# EAGLE design Logger_v2 (EAGLE 8.1.0)

## Sheet 1 of 7: Main
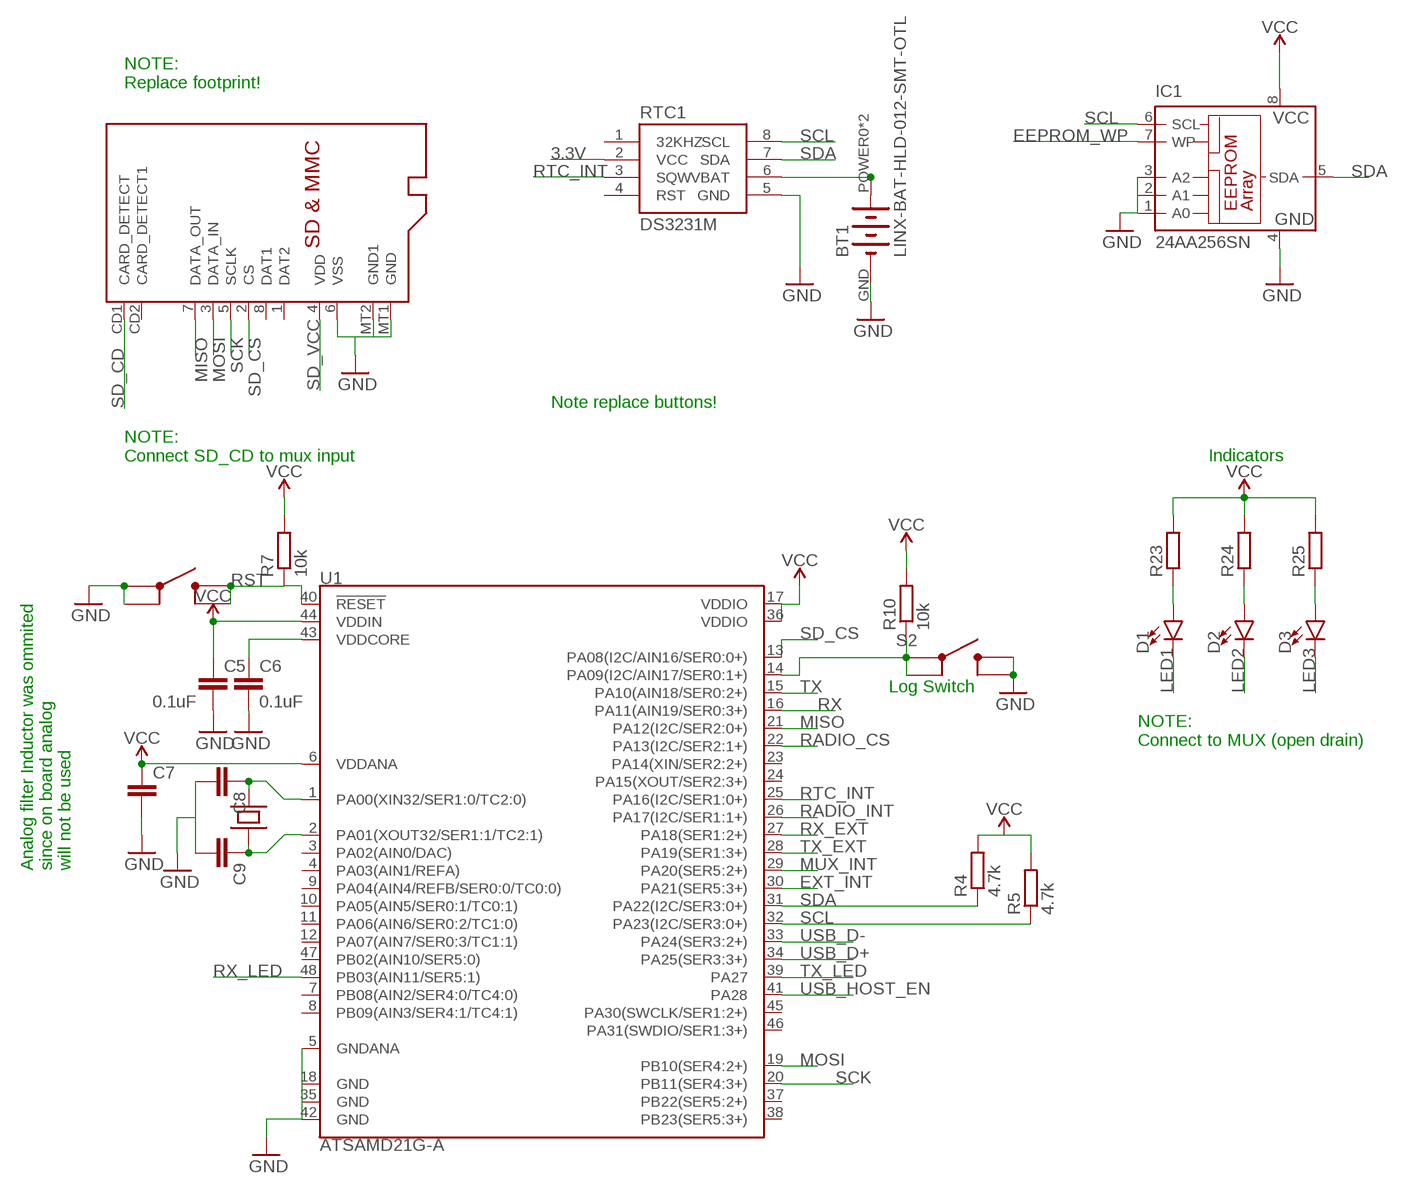
[diagram p0: schematic, sheet 1]

### Parts
BT1  LINX-BAT-HLD-012-SMT-OTL  [LINX_BAT-HLD-012-SMT]
C5  0.1uF  C-EUC0603  [C0603]
C6  0.1uF  C-EUC0603  [C0603]
C7  C-EUC0603  [C0603]
C8  C-EUC0603  [C0603]
C9  C-EUC0603  [C0603]
D1  LED0603  [LED-0603]
D2  LED0603  [LED-0603]
D3  LED0603  [LED-0603]
IC1  24AA256SN  [SO-08]
R4  4.7k  R-EU_R0603  [R0603]
R5  4.7k  R-EU_R0603  [R0603]
R7  10k  R-EU_R0603  [R0603]
R10  10k  R-EU_R0603  [R0603]
R23  R-EU_R0603  [R0603]
R24  R-EU_R0603  [R0603]
R25  R-EU_R0603  [R0603]
RTC1  DS3231M  [SO08]
S2  SKRPABE010  [SKRPABE010_(SWITCH)]
U1  ATSAMD21G-A  [TQFP-48]
U$1  SKRPABE010  [SKRPABE010_(SWITCH)]
U$2  MICROSD  [MICROSD]
U$5  CM200  [4-SOJ]

### Nets
3.3V: C5.1 C7.1 IC1.8(VCC) R4.2 R5.2 R7.2 R10.2 R23.2 R24.2 R25.2 RTC1.2(VCC) U1.6(VDDANA) U1.17(VDDIO) U1.36(VDDIO) U1.44(VDDIN) ; supply symbol labelled VCC ; also sheet 3,4,5,6,7
EEPROM_WP: IC1.7(WP)
EXT_INT: U1.30(PA21(SER5:3+)) ; also sheet 6
GND: BT1.GND(-) C5.2 C6.2 C7.2 C8.2 C9.2 IC1.1(A0) IC1.2(A1) IC1.3(A2) IC1.4(GND) RTC1.5(GND) S2.P$3 S2.P$4 U1.5(GNDANA) U1.18(GND) U1.42(GND) U$1.P$1 U$1.P$2 U$2.6(VSS) U$2.MT1(GND) U$2.MT2(GND1) ; also sheet 2,3,4,6,7
LED1: D1.C ; also sheet 7
LED2: D2.C ; also sheet 7
LED3: D3.C ; also sheet 7
MISO: U1.21(PA12(I2C/SER2:0+)) U$2.7(DATA_OUT) ; also sheet 4,6
MOSI: U1.19(PB10(SER4:2+)) U$2.3(DATA_IN) ; also sheet 4,6
MUX_INT: U1.29(PA20(SER5:2+)) ; also sheet 7
N$5: R10.1 S2.P$1 S2.P$2 U1.14(PA09(I2C/AIN17/SER0:1+))
N$8: C6.1 U1.43(VDDCORE)
N$9: C8.1 U1.1(PA00(XIN32/SER1:0/TC2:0)) U$5.P$4
N$10: C9.1 U1.2(PA01(XOUT32/SER1:1/TC2:1)) U$5.P$1
N$31: BT1.POWER0(+) BT1.POWER1(+) RTC1.6(VBAT)
N$32: D1.A R23.1
N$33: D2.A R24.1
N$34: D3.A R25.1
RADIO_CS: U1.22(PA13(I2C/SER2:1+)) ; also sheet 4
RADIO_INT: U1.26(PA17(I2C/SER1:1+)) ; also sheet 4
RST: R7.1 U1.40(!RESET!) U$1.P$3 U$1.P$4 ; also sheet 6
RTC_INT: RTC1.3(SQW) U1.25(PA16(I2C/SER1:0+))
RX: U1.16(PA11(AIN19/SER0:3+))
RX_EXT: U1.27(PA18(SER1:2+)) ; also sheet 6
RX_LED: U1.48(PB03(AIN11/SER5:1))
SCK: U1.20(PB11(SER4:3+)) U$2.5(SCLK) ; also sheet 4,6
SCL: IC1.6(SCL) R5.1 RTC1.8(SCL) U1.32(PA23(I2C/SER3:0+)) ; also sheet 4,6,7
SD_CD: U$2.CD1(CARD_DETECT)
SD_CS: U1.13(PA08(I2C/AIN16/SER0:0+)) U$2.2(CS)
SD_VCC: U$2.4(VDD) ; also sheet 5
SDA: IC1.5(SDA) R4.1 RTC1.7(SDA) U1.31(PA22(I2C/SER3:0+)) ; also sheet 4,6,7
TX: U1.15(PA10(AIN18/SER0:2+))
TX_EXT: U1.28(PA19(SER1:3+)) ; also sheet 6
TX_LED: U1.39(PA27)
USB_D+: U1.34(PA25(SER3:3+)) ; also sheet 6
USB_D-: U1.33(PA24(SER3:2+)) ; also sheet 6
USB_HOST_EN: U1.41(PA28) ; also sheet 6
Unconnected: RTC1.1(32KHZ) RTC1.4(RST) U1.3(PA02(AIN0/DAC)) U1.4(PA03(AIN1/REFA)) U1.7(PB08(AIN2/SER4:0/TC4:0)) U1.8(PB09(AIN3/SER4:1/TC4:1)) U1.9(PA04(AIN4/REFB/SER0:0/TC0:0)) U1.10(PA05(AIN5/SER0:1/TC0:1)) U1.11(PA06(AIN6/SER0:2/TC1:0)) U1.12(PA07(AIN7/SER0:3/TC1:1)) U1.23(PA14(XIN/SER2:2+)) U1.24(PA15(XOUT/SER2:3+)) U1.35(GND) U1.37(PB22(SER5:2+)) U1.38(PB23(SER5:3+)) U1.45(PA30(SWCLK/SER1:2+)) U1.46(PA31(SWDIO/SER1:3+)) U1.47(PB02(AIN10/SER5:0)) U$2.1(DAT2) U$2.8(DAT1) U$2.CD2(CARD_DETECT1)

### Notes on the sheet
- NOTE:
  Replace footprint!
- Note replace buttons!
- NOTE:
  Connect SD_CD to mux input
- Indicators
- Log Switch
- NOTE:
  Connect to MUX (open drain)
- Analog filter Inductor was ommited
  since on board analog
  will not be used

## Sheet 2 of 7: User Custom
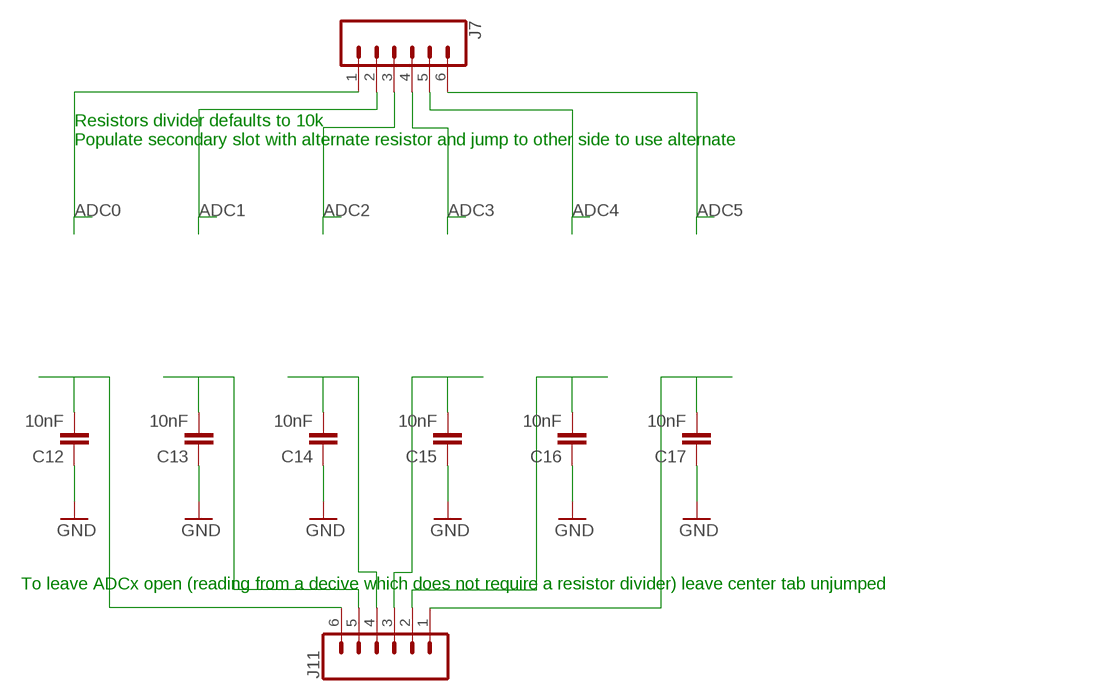
[diagram p1: schematic, sheet 2]

### Parts
C12  10nF  C-EUC0603  [C0603]
C13  10nF  C-EUC0603  [C0603]
C14  10nF  C-EUC0603  [C0603]
C15  10nF  C-EUC0603  [C0603]
C16  10nF  C-EUC0603  [C0603]
C17  10nF  C-EUC0603  [C0603]
J7  CONN_06SMD-STRAIGHT-FEMALE  [1X06_SMD_STRAIGHT]
J11  CONN_06SMD-STRAIGHT-FEMALE  [1X06_SMD_STRAIGHT]

### Nets
ADC0: J7.1 ; also sheet 6,7
ADC1: J7.2 ; also sheet 6,7
ADC2: J7.3 ; also sheet 6,7
ADC3: J7.4 ; also sheet 6,7
ADC4: J7.5 ; also sheet 6,7
ADC5: J7.6 ; also sheet 6,7
GND: C12.1 C13.1 C14.1 C15.1 C16.1 C17.1 ; also sheet 1,3,4,6,7
N$44: C12.2 J11.6
N$45: C13.2 J11.5
N$46: C14.2 J11.4
N$47: C15.2 J11.3
N$48: C16.2 J11.2
N$49: C17.2 J11.1

### Notes on the sheet
- Resistors divider defaults to 10k
  Populate secondary slot with alternate resistor and jump to other side to use alternate
- To leave ADCx open (reading from a decive which does not require a resistor divider) leave center tab unjumped

## Sheet 3 of 7: Power
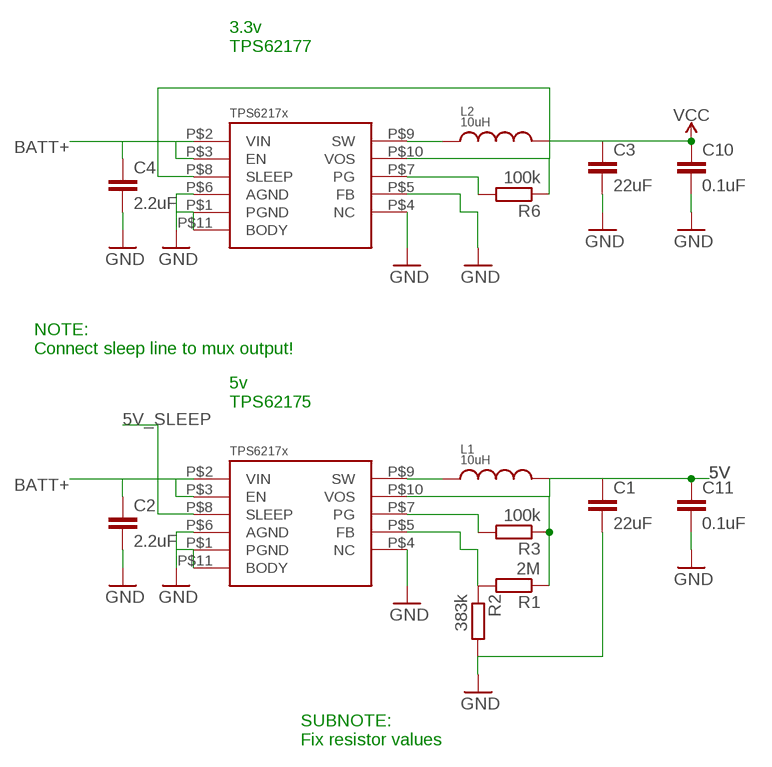
[diagram p2: schematic, sheet 3]

### Parts
C1  22uF  C-EUC1210  [C1210]
C2  2.2uF  C-EUC0603  [C0603]
C3  22uF  C-EUC1210  [C1210]
C4  2.2uF  C-EUC0603  [C0603]
C10  0.1uF  C-EUC0603  [C0603]
C11  0.1uF  C-EUC0603  [C0603]
L1  10uH  WE-LSQ(INDUCTOR)  [WE-LQS(INDUCTOR)]
L2  10uH  WE-LSQ(INDUCTOR)  [WE-LQS(INDUCTOR)]
R1  2M  R-EU_R0603  [R0603]
R2  383k  R-EU_R0603  [R0603]
R3  100k  R-EU_R0603  [R0603]
R6  100k  R-EU_R0603  [R0603]
U$3  TPS6217X  [WSON-10]
U$4  TPS6217X  [WSON-10]

### Nets
3.3V: C3.1 C10.1 L2.P$2 R6.1 U$4.P$8(SLEEP) U$4.P$10(VOS) ; supply symbol labelled VCC ; also sheet 1,4,5,6,7
5V: C1.1 C11.1 L1.P$2 R1.1 R3.1 U$3.P$10(VOS) ; also sheet 5,6,7
5V_SLEEP: U$3.P$8(SLEEP)
BATT+: C2.1 C4.1 U$3.P$2(VIN) U$3.P$3(EN) U$4.P$2(VIN) U$4.P$3(EN) ; also sheet 6,7
GND: C1.2 C2.2 C3.2 C4.2 C10.2 C11.2 R2.2 U$3.P$1(PGND) U$3.P$4(NC) U$3.P$6(AGND) U$3.P$11(BODY) U$4.P$1(PGND) U$4.P$4(NC) U$4.P$5(FB) U$4.P$6(AGND) U$4.P$11(BODY) ; also sheet 1,2,4,6,7
N$1: L1.P$1 U$3.P$9(SW)
N$2: L2.P$1 U$4.P$9(SW)
N$3: R1.2 R2.1 U$3.P$5(FB)
N$4: R3.2 U$3.P$7(PG)
N$6: R6.2 U$4.P$7(PG)

### Notes on the sheet
- 3.3v
  TPS62177
- NOTE:
  Connect sleep line to mux output!
- 5v
  TPS62175
- SUBNOTE:
  Fix resistor values

## Sheet 4 of 7: RF
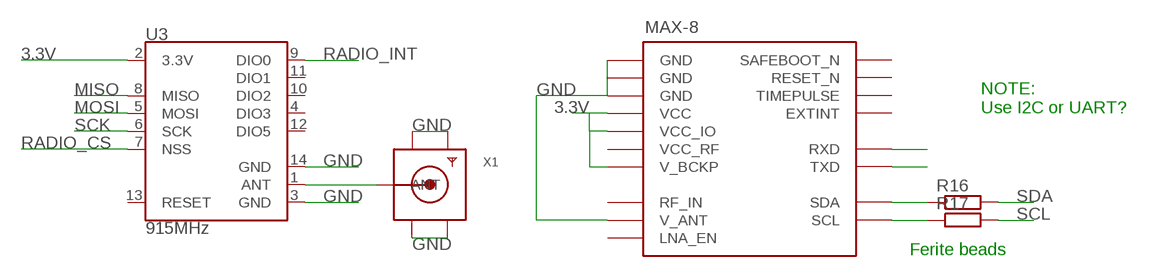
[diagram p3: schematic, sheet 4]

### Parts
R16  R-EU_R0603  [R0603]
R17  R-EU_R0603  [R0603]
U3  915MHz  RFM69CW-915MHZ  [RFM69CW-XXXS2]
U$6  UBLOX_MAX-8  [MAX-8]
X1  SMACONNECTOR_EDGE  [SMA_EDGELAUNCH]

### Nets
3.3V: U3.2(3.3V) U$6.P$6(V_BCKP) U$6.P$7(VCC_IO) U$6.P$8(VCC) ; also sheet 1,3,5,6,7
GND: U3.3(GND) U3.14(GND) U$6.P$1(GND) U$6.P$10(GND) U$6.P$12(GND) U$6.P$15(V_ANT) X1.GND@1(GND4) X1.GND@2(GND3) X1.GND@3(GND2) X1.GND@4(GND1) ; also sheet 1,2,3,6,7
MISO: U3.8(MISO) ; also sheet 1,6
MOSI: U3.5(MOSI) ; also sheet 1,6
N$21: R16.1 U$6.P$16(SDA)
N$22: R17.1 U$6.P$17(SCL)
N$23: U$6.P$3(RXD)
N$24: U$6.P$2(TXD)
N$28: U3.1(ANT) X1.P(ANT)
RADIO_CS: U3.7(NSS) ; also sheet 1
RADIO_INT: U3.9(DIO0) ; also sheet 1
SCK: U3.6(SCK) ; also sheet 1,6
SCL: R17.2 ; also sheet 1,6,7
SDA: R16.2 ; also sheet 1,6,7
Unconnected: U3.4(DIO3) U3.10(DIO2) U3.11(DIO1) U3.12(DIO5) U3.13(RESET) U$6.P$4(TIMEPULSE) U$6.P$5(EXTINT) U$6.P$9(RESET_N) U$6.P$11(RF_IN) U$6.P$13(LNA_EN) U$6.P$18(SAFEBOOT_N)

### Notes on the sheet
- NOTE:
  Use I2C or UART?
- Ferite beads

## Sheet 5 of 7: Power Control
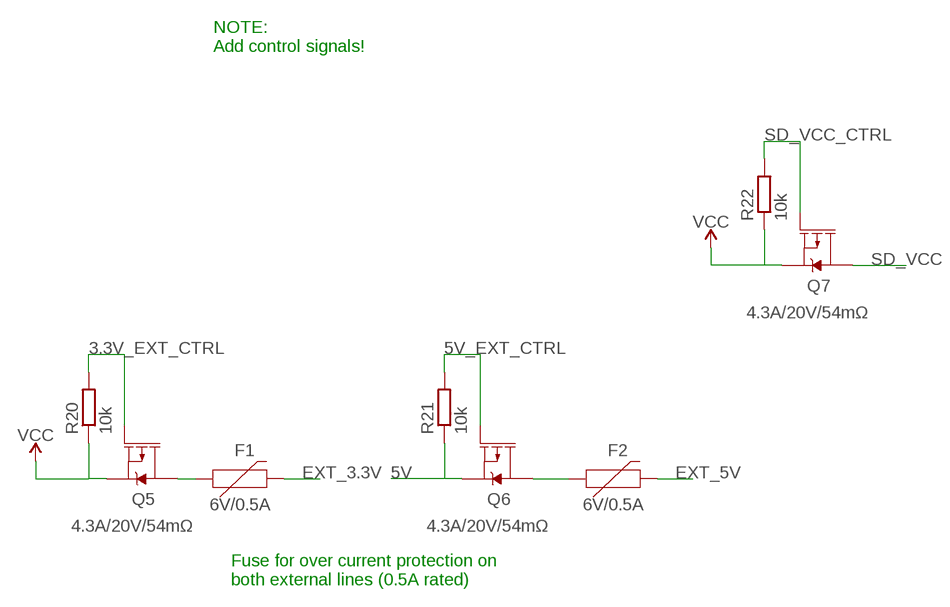
[diagram p4: schematic, sheet 5]

### Parts
F1  6V/0.5A  PPTC_HALF-AMP  [1206]
F2  6V/0.5A  PPTC_HALF-AMP  [1206]
Q5  4.3A/20V/54mΩ  MOSFET_PCH-IRLML2244  [SOT23-3]
Q6  4.3A/20V/54mΩ  MOSFET_PCH-IRLML2244  [SOT23-3]
Q7  4.3A/20V/54mΩ  MOSFET_PCH-IRLML2244  [SOT23-3]
R20  10k  R-EU_R0603  [R0603]
R21  10k  R-EU_R0603  [R0603]
R22  10k  R-EU_R0603  [R0603]

### Nets
3.3V: Q5.2(S) Q7.2(S) R20.1 R22.1 ; supply symbol labelled VCC ; also sheet 1,3,4,6,7
3.3V_EXT_CTRL: Q5.1(G) R20.2 ; also sheet 7
5V: Q6.2(S) R21.1 ; also sheet 3,6,7
5V_EXT_CTRL: Q6.1(G) R21.2 ; also sheet 7
EXT_3.3V: F1.2 ; also sheet 6
EXT_5V: F2.2 ; also sheet 6
N$14: F1.1 Q5.3(D)
N$18: F2.1 Q6.3(D)
SD_VCC: Q7.3(D) ; also sheet 1
SD_VCC_CTRL: Q7.1(G) R22.2 ; also sheet 7

### Notes on the sheet
- NOTE:
  Add control signals!
- Fuse for over current protection on
  both external lines (0.5A rated)

## Sheet 6 of 7: Ports
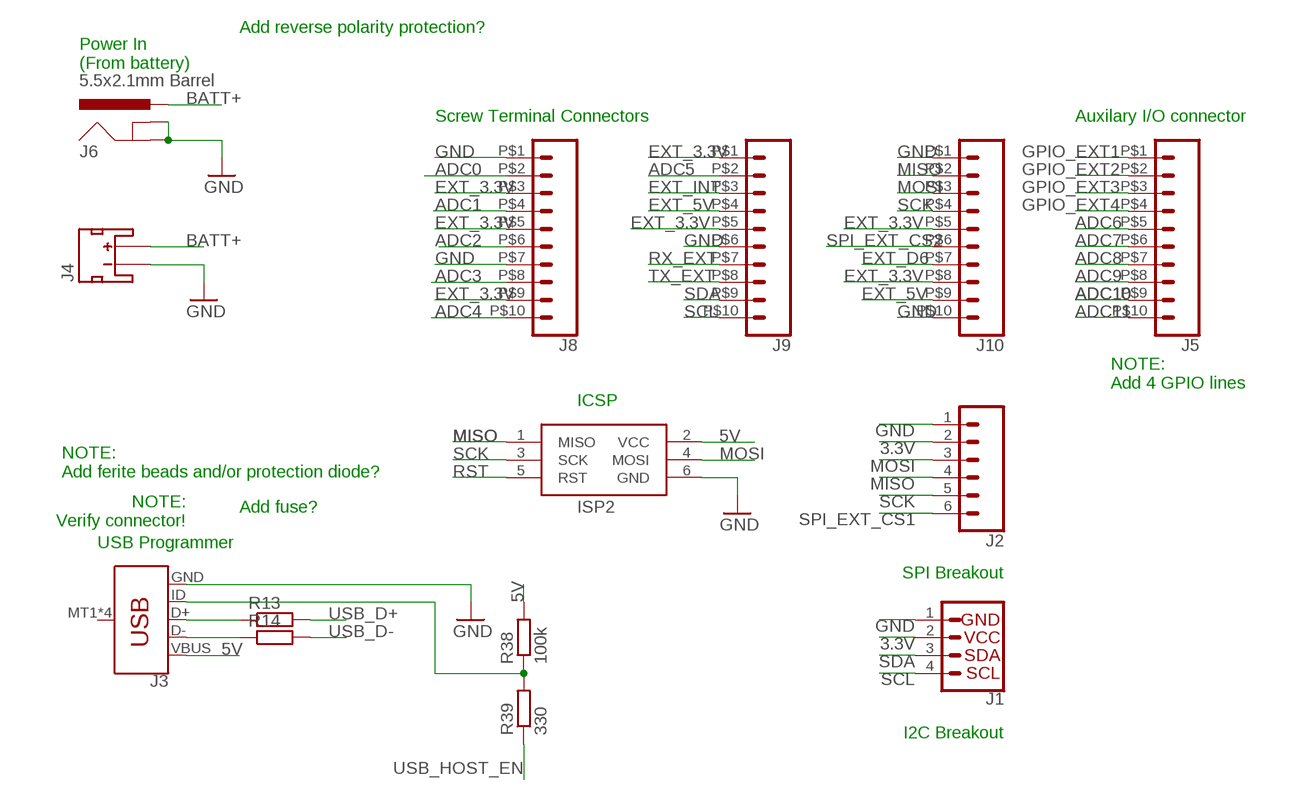
[diagram p5: schematic, sheet 6]

### Parts
ISP2  AVRISP-6  [AVRISP]
J1  I2C_STANDARD  [1X04]
J2  CONN_06SILK_FEMALE_PTH  [1X06]
J3  USB_MICRO-B_SMT  [USB-MICROB]
J4  JST_2MM_MALE  [JST-2-SMD]
J5  CONN_10  [SCREWTERMINAL-3.5MM-10]
J6  5.5x2.1mm Barrel  POWER_JACKSMD  [POWER_JACK_SMD]
J8  CONN_10  [SCREWTERMINAL-3.5MM-10]
J9  CONN_10  [SCREWTERMINAL-3.5MM-10]
J10  CONN_10  [SCREWTERMINAL-3.5MM-10]
R13  R-EU_R0603  [R0603]
R14  R-EU_R0603  [R0603]
R38  100k  R-EU_R0603  [R0603]
R39  330  R-EU_R0603  [R0603]

### Nets
3.3V: J1.2 J2.2 ; also sheet 1,3,4,5,7
5V: ISP2.2(VCC) J3.VBUS R38.2 ; also sheet 3,5,7
ADC0: J8.P$2 ; also sheet 2,7
ADC1: J8.P$4 ; also sheet 2,7
ADC2: J8.P$6 ; also sheet 2,7
ADC3: J8.P$8 ; also sheet 2,7
ADC4: J8.P$10 ; also sheet 2,7
ADC5: J9.P$2 ; also sheet 2,7
ADC6: J5.P$5 ; also sheet 7
ADC7: J5.P$6 ; also sheet 7
ADC8: J5.P$7 ; also sheet 7
ADC9: J5.P$8 ; also sheet 7
ADC10: J5.P$9 ; also sheet 7
ADC11: J5.P$10 ; also sheet 7
BATT+: J4.2(+) J6.VIN0(PWR) ; also sheet 3,7
EXT_3.3V: J8.P$3 J8.P$5 J8.P$9 J9.P$1 J9.P$5 J10.P$5 J10.P$8 ; also sheet 5
EXT_5V: J9.P$4 J10.P$9 ; also sheet 5
EXT_D6: J10.P$7 ; also sheet 7
EXT_INT: J9.P$3 ; also sheet 1
GND: ISP2.6(GND) J1.1 J2.1 J3.GND J4.1(-) J6.GND(GNDBREAK) J6.P$4(GND) J8.P$1 J8.P$7 J9.P$6 J10.P$1 J10.P$10 ; also sheet 1,2,3,4,7
GPIO_EXT1: J5.P$1 ; also sheet 7
GPIO_EXT2: J5.P$2 ; also sheet 7
GPIO_EXT3: J5.P$3 ; also sheet 7
GPIO_EXT4: J5.P$4 ; also sheet 7
MISO: ISP2.1(MISO) J2.4 J10.P$2 ; also sheet 1,4
MOSI: ISP2.4(MOSI) J2.3 J10.P$3 ; also sheet 1,4
N$15: J3.D+ R13.1
N$16: J3.D- R14.1
N$50: J3.ID R38.1 R39.2
RST: ISP2.5(RST) ; also sheet 1
RX_EXT: J9.P$7 ; also sheet 1
SCK: ISP2.3(SCK) J2.5 J10.P$4 ; also sheet 1,4
SCL: J1.4 J9.P$10 ; also sheet 1,4,7
SDA: J1.3 J9.P$9 ; also sheet 1,4,7
SPI_EXT_CS1: J2.6 ; also sheet 7
SPI_EXT_CS2: J10.P$6 ; also sheet 7
TX_EXT: J9.P$8 ; also sheet 1
USB_D+: R13.2 ; also sheet 1
USB_D-: R14.2 ; also sheet 1
USB_HOST_EN: R39.1 ; also sheet 1
Unconnected: J3.MT1(SHIELD) J3.MT2(SHIELD) J3.P$1(SHIELD) J3.P$2(SHIELD) J4.NC1(PAD1) J4.NC2(PAD2)

### Notes on the sheet
- Add reverse polarity protection?
- Power In
  (From battery)
- Screw Terminal Connectors | Auxilary I/O connector
- NOTE:
  Add 4 GPIO lines
- ICSP
- NOTE:
  Add ferite beads and/or protection diode?
- NOTE:
  Verify connector!
- Add fuse?
- USB Programmer
- SPI Breakout
- I2C Breakout

## Sheet 7 of 7: IO
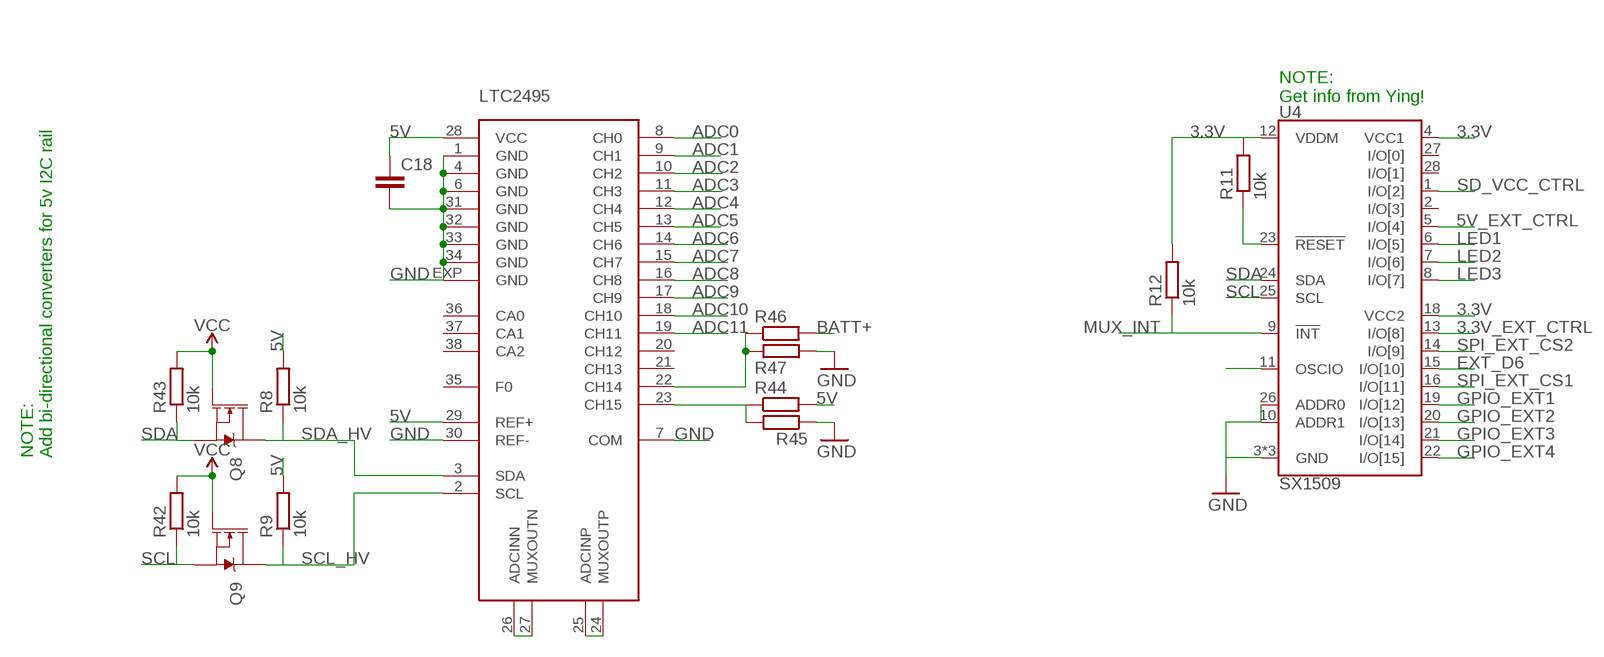
[diagram p6: schematic, sheet 7]

### Parts
C18  C-EUC0603  [C0603]
Q8  220mA/50V/3.5Ω  MOSFET-NCH-BSS138  [SOT23-3]
Q9  220mA/50V/3.5Ω  MOSFET-NCH-BSS138  [SOT23-3]
R8  10k  R-EU_R0603  [R0603]
R9  10k  R-EU_R0603  [R0603]
R11  10k  R-EU_R0603  [R0603]
R12  10k  R-EU_R0603  [R0603]
R42  10k  R-EU_R0603  [R0603]
R43  10k  R-EU_R0603  [R0603]
R44  R-EU_R0603  [R0603]
R45  R-EU_R0603  [R0603]
R46  R-EU_R0603  [R0603]
R47  R-EU_R0603  [R0603]
U4  SX1509  [QFN-28]
U$7  LTC2495  [QFN38-5X7]

### Nets
3.3V: Q8.1(G) Q9.1(G) R11.2 R12.2 R42.2 R43.2 U4.4(VCC1) U4.12(VDDM) U4.18(VCC2) ; supply symbol labelled VCC ; also sheet 1,3,4,5,6
3.3V_EXT_CTRL: U4.13(I/O[8]) ; also sheet 5
5V: C18.1 R8.2 R9.2 R44.2 U$7.28(VCC) U$7.29(REF+) ; also sheet 3,5,6
5V_EXT_CTRL: U4.5(I/O[4]) ; also sheet 5
ADC0: U$7.8(CH0) ; also sheet 2,6
ADC1: U$7.9(CH1) ; also sheet 2,6
ADC2: U$7.10(CH2) ; also sheet 2,6
ADC3: U$7.11(CH3) ; also sheet 2,6
ADC4: U$7.12(CH4) ; also sheet 2,6
ADC5: U$7.13(CH5) ; also sheet 2,6
ADC6: U$7.14(CH6) ; also sheet 6
ADC7: U$7.15(CH7) ; also sheet 6
ADC8: U$7.16(CH8) ; also sheet 6
ADC9: U$7.17(CH9) ; also sheet 6
ADC10: U$7.18(CH10) ; also sheet 6
ADC11: U$7.19(CH11) ; also sheet 6
BATT+: R46.2 ; also sheet 3,6
EXT_D6: U4.15(I/O[10]) ; also sheet 6
GND: C18.2 R45.1 R47.2 U4.3(GND) U4.10(ADDR1) U4.17(GND) U4.26(ADDR0) U4.29(GND) U$7.1(GND) U$7.4(GND) U$7.6(GND) U$7.7(COM) U$7.30(REF-) U$7.31(GND) U$7.32(GND) U$7.33(GND) U$7.34(GND) U$7.EXP(GND) ; also sheet 1,2,3,4,6
GPIO_EXT1: U4.19(I/O[12]) ; also sheet 6
GPIO_EXT2: U4.20(I/O[13]) ; also sheet 6
GPIO_EXT3: U4.21(I/O[14]) ; also sheet 6
GPIO_EXT4: U4.22(I/O[15]) ; also sheet 6
LED1: U4.6(I/O[5]) ; also sheet 1
LED2: U4.7(I/O[6]) ; also sheet 1
LED3: U4.8(I/O[7]) ; also sheet 1
MUX_INT: R12.1 U4.9(!INT) ; also sheet 1
N$13: U$7.26(ADCINN) U$7.27(MUXOUTN)
N$27: U4.11(OSCIO)
N$52: U$7.24(MUXOUTP) U$7.25(ADCINP)
N$53: R44.1 R45.2 U$7.23(CH15)
N$54: R46.1 R47.1 U$7.22(CH14)
N$56: R11.1 U4.23(!RESET)
SCL: Q9.2(S) R42.1 U4.25(SCL) ; also sheet 1,4,6
SCL_HV: Q9.3(D) R9.1 U$7.2(SCL)
SD_VCC_CTRL: U4.1(I/O[2]) ; also sheet 5
SDA: Q8.2(S) R43.1 U4.24(SDA) ; also sheet 1,4,6
SDA_HV: Q8.3(D) R8.1 U$7.3(SDA)
SPI_EXT_CS1: U4.16(I/O[11]) ; also sheet 6
SPI_EXT_CS2: U4.14(I/O[9]) ; also sheet 6
Unconnected: U4.2(I/O[3]) U4.27(I/O[0]) U4.28(I/O[1]) U$7.20(CH12) U$7.21(CH13) U$7.35(F0) U$7.36(CA0) U$7.37(CA1) U$7.38(CA2)

### Notes on the sheet
- NOTE:
  Get info from Ying!
- NOTE:
  Add bi-directional converters for 5v I2C rail

## Power pins joined to a net without a drawn wire
VCC_RF: U$6.P$14(VCC_RF)

## Library data of the parts
BT1 = awickert:LINX-BAT-HLD-012-SMT-OTL
C1-C18 = rcl:C-EU: CAPACITOR, European symbol
D1-D3 = SparkFun-LED:LED: LED (Generic) Standard schematic elements and footprints for 5mm, 3mm, 1206, and 0603 sized LEDs. Generic LEDs with no color specified.
F1 F2 = SparkFun-Fuses:PPTC: Resettable Fuse PPTC Resettable Fuse. Really a sort of resistor with a polymeric positive temperature coefficient whose resistance increases dramatically with an increase in temperature. When heated by the power passing through the resistance rises causing the current to be limited, protecting the circuit. This is achieved by the transition of the polymer from a crystalline to an amorphous state where the conductive carbon separates breaking the conductive pathways found in the cool crystalline structure. When a PPTC cools back down it resumes conducting letting the circuit turn back on. SparkFun Products: SparkFun RedBoard - Programmed with Arduino <https://www.sparkfun.com/products/12757> Pro Micro - 5V/16MHz <https://www.sparkfun.com/products/12640> Arduino Pro 328 - 5V/16MHz <https://www.sparkfun.com/products/10915> MP3 Trigger <https://www.sparkfun.com/products/13720>; PROD_ID: RES-08585
IC1 = microchip:24*: Serial EEPROM I2C; MPN: 24AA256T-I/SM; OC_FARNELL: 1579570; OC_NEWARK: 08N6838
ISP2 = adafruit:AVRISP: AVR ISP HEADER Standard 6 pin header for AVR programming
J1 = SparkFun-Connectors:I2C_STANDARD: SparkFun I2C Standard Pinout Header SparkFun has standardized on a pinout for all I2C based sensor breakouts. This pinout allows I2C boards to be plugged directly into the headers on Arduino Uno compatible boards, and to be daisy chained easily. Example SparkFun Products: SparkFun Atmospheric Sensor Breakout - BME280 <https://www.sparkfun.com/products/13676> SparkFun Altitude/Pressure Sensor Breakout - MPL3115A2 <https://www.sparkfun.com/products/11084> SparkFun TOF Range Finder Sensor - VL6180 <https://www.sparkfun.com/products/12785>
J2 = SparkFun-Connectors:CONN_06: Multi connection point. Often used as Generic Header-pin footprint for 0.1 inch spaced/style header connections On any of the 0.1 inch spaced packages, you can populate with these: Break Away Headers - Straight <https://www.sparkfun.com/products/116> (PRT-00116) Break Away Male Headers - Right Angle <https://www.sparkfun.com/products/553> (PRT-00553) Female Headers <https://www.sparkfun.com/products/115> (PRT-00115) Break Away Headers - Machine Pin <https://www.sparkfun.com/products/117> (PRT-00117) Break Away Female Headers - Swiss Machine Pin <https://www.sparkfun.com/products/743> (PRT-00743) Arduino Stackable Header - 6 Pin <https://www.sparkfun.com/products/9280> (PRT-09280) For SCREWTERMINALS and SPRING TERMINALS visit here: Screw Terimnals on SparkFun.com <https://www.sparkfun.com/search/results?term=Screw+Terminals> (5mm/3.5mm/2.54mm spacing) This device is also useful as a general connection point to wire up your design to another part of your project. Our various solder wires solder well into these plated through hole pads. Hook-Up Wire - Assortment (Stranded, 22 AWG) <https://www.sparkfun.com/products/11375> (PRT-11375) Hook-Up Wire - Assortment (Solid Core, 22 AWG) <https://www.sparkfun.com/products/11367> (PRT-11367) View the entire wire category on our website here <https://www.sparkfun.com/categories/141>; PROD_ID: CONN-08437
J3 = SparkFun-Connectors:USB_MICRO-B: USB Type Micro-B Connector Male/female and PTH/SMT variants SparkFun Products: SparkFun microB USB Breakout <https://www.sparkfun.com/products/12035> SparkFun USB microB Plug Breakout <https://www.sparkfun.com/products/10031> SparkFun ESP8266 Thing <https://www.sparkfun.com/products/13231>; PROD_ID: CONN-09505; SF_ID: PRT-08533
J4 = SparkFun-Connectors:JST_2MM_MALE: JST 2MM MALE RA CONNECTOR Two pin, compact surface mount connector. Commonly used as a battery input connection point. We really like the solid locking feeling and high current rating on these small connectors. We use these all the time as battery connectors. Mates to single-cell LiPo batteries. Here is the connector we sell at SparkFun: JST Right Angle Connector - White <https://www.sparkfun.com/products/8612> (PRT-08612) Datasheet <http://www.sparkfun.com/datasheets/Prototyping/Connectors/JST-Horizontal.pdf> It was used on these SparkFun products: SparkFun MOSFET Power Controller <https://www.sparkfun.com/products/11214> (PRT-11214) SparkFun Battery Babysitter - LiPo Battery Manager <https://www.sparkfun.com/products/13777> (PRT-13777) And many, many others that required a lipo battery connection.; PROD_ID: CONN-11443; SF_ID: PRT-08612
J5 J8-J10 = SparkFun-Connectors:CONN_10: Multi connection point. Often used as Generic Header-pin footprint for 0.1 inch spaced/style header connections On any of the 0.1 inch spaced packages, you can populate with these: Break Away Headers - Straight <https://www.sparkfun.com/products/116> (PRT-00116) Break Away Male Headers - Right Angle <https://www.sparkfun.com/products/553> (PRT-00553) Female Headers <https://www.sparkfun.com/products/115> (PRT-00115) Break Away Headers - Machine Pin <https://www.sparkfun.com/products/117> (PRT-00117) Break Away Female Headers - Swiss Machine Pin <https://www.sparkfun.com/products/743> (PRT-00743) Arduino Stackable Header - 10 Pin <https://www.sparkfun.com/products/11376> (PRT-11376) For SCREWTERMINALS and SPRING TERMINALS visit here: Screw Terimnals on SparkFun.com <https://www.sparkfun.com/search/results?term=Screw+Terminals> (5mm/3.5mm/2.54mm spacing) This device is also useful as a general connection point to wire up your design to another part of your project. Our various solder wires solder well into these plated through hole pads. Hook-Up Wire - Assortment (Stranded, 22 AWG) <https://www.sparkfun.com/products/11375> (PRT-11375) Hook-Up Wire - Assortment (Solid Core, 22 AWG) <https://www.sparkfun.com/products/11367> (PRT-11367) View the entire wire category on our website here <https://www.sparkfun.com/categories/141> Special notes: Molex polarized connector foot print use with SKU : PRT-08231 with associated crimp pins and housings. 1MM SMD Version SKU: PRT-10208 NOTES ON THE VARIANTS LOCK and LOCK_LONGPADS... This footprint was designed to help hold the alignment of a through-hole component (i.e. 6-pin header) while soldering it into place. You may notice that each hole has been shifted either up or down by 0.005 of an inch from it's more standard position (which is a perfectly straight line). This slight alteration caused the pins (the squares in the middle) to touch the edges of the holes. Because they are alternating, it causes a "brace" to hold the component in place. 0.005 has proven to be the perfect amount of "off-center" position when using our standard breakaway headers. Although looks a little odd when you look at the bare footprint, once you have a header in there, the alteration is very hard to notice. Also,if you push a header all the way into place, it is covered up entirely on the bottom side.
J6 = SparkFun-Connectors:POWER_JACK: Power Jack Connector This is the standard 5.5mm barrel jack for power. The PTH is the most common, proven, reliable, footprint. The Slot footprint only works if the mill layer is transmitted to the PCB fab house so be warned. Here are the connectors we sell at SparkFun: DC Barrel Power Jack/Connector <https://www.sparkfun.com/products/119> (PRT-00119) DC Barrel Power Jack/Connector (SMD) <https://www.sparkfun.com/products/12748> (PRT-12748) DC Barrel Jack Adapter - Breadboard Compatible <https://www.sparkfun.com/products/10811> (PRT-10811) It is used on this SparkFun product (and many, many others): SparkFun RedBoard - Programmed with Arduino <https://www.sparkfun.com/products/12757> (DEV-12757) Also, if you need a mating power supply or connector, please check these out: Wall Adapter Power Supply - 9VDC 650mA <https://www.sparkfun.com/products/298> (TOL-00298) DC Barrel Jack Adapter - Male <https://www.sparkfun.com/products/10287> (PRT-10287); PROD_ID: CONN-08106; SF_ID: PRT-12748
J7 J11 = SparkFun-Connectors:CONN_06: Multi connection point. Often used as Generic Header-pin footprint for 0.1 inch spaced/style header connections On any of the 0.1 inch spaced packages, you can populate with these: Break Away Headers - Straight <https://www.sparkfun.com/products/116> (PRT-00116) Break Away Male Headers - Right Angle <https://www.sparkfun.com/products/553> (PRT-00553) Female Headers <https://www.sparkfun.com/products/115> (PRT-00115) Break Away Headers - Machine Pin <https://www.sparkfun.com/products/117> (PRT-00117) Break Away Female Headers - Swiss Machine Pin <https://www.sparkfun.com/products/743> (PRT-00743) Arduino Stackable Header - 6 Pin <https://www.sparkfun.com/products/9280> (PRT-09280) For SCREWTERMINALS and SPRING TERMINALS visit here: Screw Terimnals on SparkFun.com <https://www.sparkfun.com/search/results?term=Screw+Terminals> (5mm/3.5mm/2.54mm spacing) This device is also useful as a general connection point to wire up your design to another part of your project. Our various solder wires solder well into these plated through hole pads. Hook-Up Wire - Assortment (Stranded, 22 AWG) <https://www.sparkfun.com/products/11375> (PRT-11375) Hook-Up Wire - Assortment (Solid Core, 22 AWG) <https://www.sparkfun.com/products/11367> (PRT-11367) View the entire wire category on our website here <https://www.sparkfun.com/categories/141>; PROD_ID: CONN-10203
L1 L2 = Custom:WE-LSQ(INDUCTOR)
Q5-Q7 = SparkFun-DiscreteSemi:MOSFET_PCH: P-channel MOSFETs Voltage controlled devices that allow control of high current outputs. SparkFun Products: SparkFun ESP32 Thing <https://www.sparkfun.com/products/13907> SparkFun ESP8266 Thing <https://www.sparkfun.com/products/13231>; PROD_ID: TRANS-11153
Q8 Q9 = SparkFun-DiscreteSemi:MOSFET-NCH: N-channel MOSFETs Voltage controlled devices that allow control of high current outputs. SparkFun Products: SparkFun OpenScale <https://www.sparkfun.com/products/13261> SparkFun Digital Sandbox <https://www.sparkfun.com/products/12651> SparkFun Monster Moto Shield <https://www.sparkfun.com/products/10182> SparkFun MOSFET Power Controller <https://www.sparkfun.com/products/11214>; PROD_ID: TRANS-00830
R1-R14 R16 R17 R20-R25 R38 R39 R42-R47 = rcl:R-EU_: RESISTOR, European symbol
RTC1 = SparkFun-Clocks:DS3231M: DS3231M Real Time Clock Accuracy +/-5ppm. Battery Backup. 2.3V to 5.5V. Datasheet <https://cdn.sparkfun.com/datasheets/Dev/Beagle/DS3231M.pdf> SparkFun Products CryptoCape <https://www.sparkfun.com/products/12773> (DEV-12773) SparkFun CryptoShield <https://www.sparkfun.com/products/13183> (DEV-13183); PROD_ID: IC-11985
S2 U$1 = Custom:SKRPABE010: SPST Switch Rated to 50 mA 16V (DC)
U1 = SparkFun-IC-Microcontroller:ATSAMD21G: Atmel SAMD21G SMART ARM-Based Microcontroller The Atmel ® | SMART ™ SAM D21 is a series of low-power microcontrollers using the 32-bit ARM ® Cortex ® -M0+ processor, and ranging from 32- to 64-pins with up to 256KB Flash and 32KB of SRAM. The SAM D21 devices operate at a maximum frequency of 48MHz and reach 2.46 CoreMark/MHz. They are designed for simple and intuitive migration with identical peripheral modules, hex compatible code, identical linear address map and pin compatible migration paths between all devices in the product series. All devices include intelligent and flexible peripherals, Atmel Event System for inter-peripheral signaling, and support for capacitive touch button, slider and wheel user interfaces. Datasheet <https://cdn.sparkfun.com/datasheets/Dev/Arduino/Boards/Atmel-42181-SAM-D21_Datasheet.pdf> SparkFun Products SparkFun SAMD21 Mini Breakout <https://www.sparkfun.com/products/13664> (DEV-13664) SparkFun SAMD21 Dev Breakout <https://www.sparkfun.com/products/13672> (DEV-13672); PROD_ID: IC-13064
U3 = SparkFun-RF:RFM69: Hope RF RFM69CW ISM Transceiver Module The RFM69CW radio module by HopeRF is a compact, powerful radio transceiver module for swapping data packets in the 868 MHz ISM band, using standard and enhanced FSK modulation. The radio is great for sub-compact designs; just 4mm of mounted height from using an SMD precision crystal. Datasheet <http://www.hoperf.com/upload/rf/RFM69CW-V1.1.pdf>; PROD_ID: IC-11996
U4 = SparkFun-IC-Special-Function:SX1509: Semtech SX1509 The SX1509 is a complete ultra low voltage 1.2V to 3.6V General Purpose parallel Input/Output (GPIO) expanders ideal for low power handheld battery powered equipment. This version comes in a 16-channel configuration and allows easy serial expansion of I/O through a standard 400kHz I2C interface. GPIO devices can provide additional control and monitoring when the microcontroller or chipset has insufficient I/O ports, or in systems where serial communication and control from a remote location is advantageous. Datasheet <http://cdn.sparkfun.com/datasheets/BreakoutBoards/sx1509.pdf> SparkFun Products SparkFun 16 Output I/O Expander Breakout - SX1509 <https://www.sparkfun.com/products/13601> (BOB-13601) SparkFun Line Follower Array <https://www.sparkfun.com/products/13582> (SEN-13582); PROD_ID: IC-11311
U$2 = adafruit:MICROSD: Micro-SD / Transflash card holder with SPI pinout For the 3M # 2908-05WB-MG and/or 4UCON #19656 push-push type
U$3 U$4 = texas:TPS6217X
U$5 = Custom:CM200: Crystal Oscilator, 32.768 kHz
U$6 = Custom:UBLOX_MAX-8: UBLOX MAX-8 GPS module
U$7 = linear-technology:LTC2495
X1 = adafruit:SMACONNECTOR: SMA Connector 90° DIP SMA Connector, 50 Ohm (4UConnector: 07259)

## Board
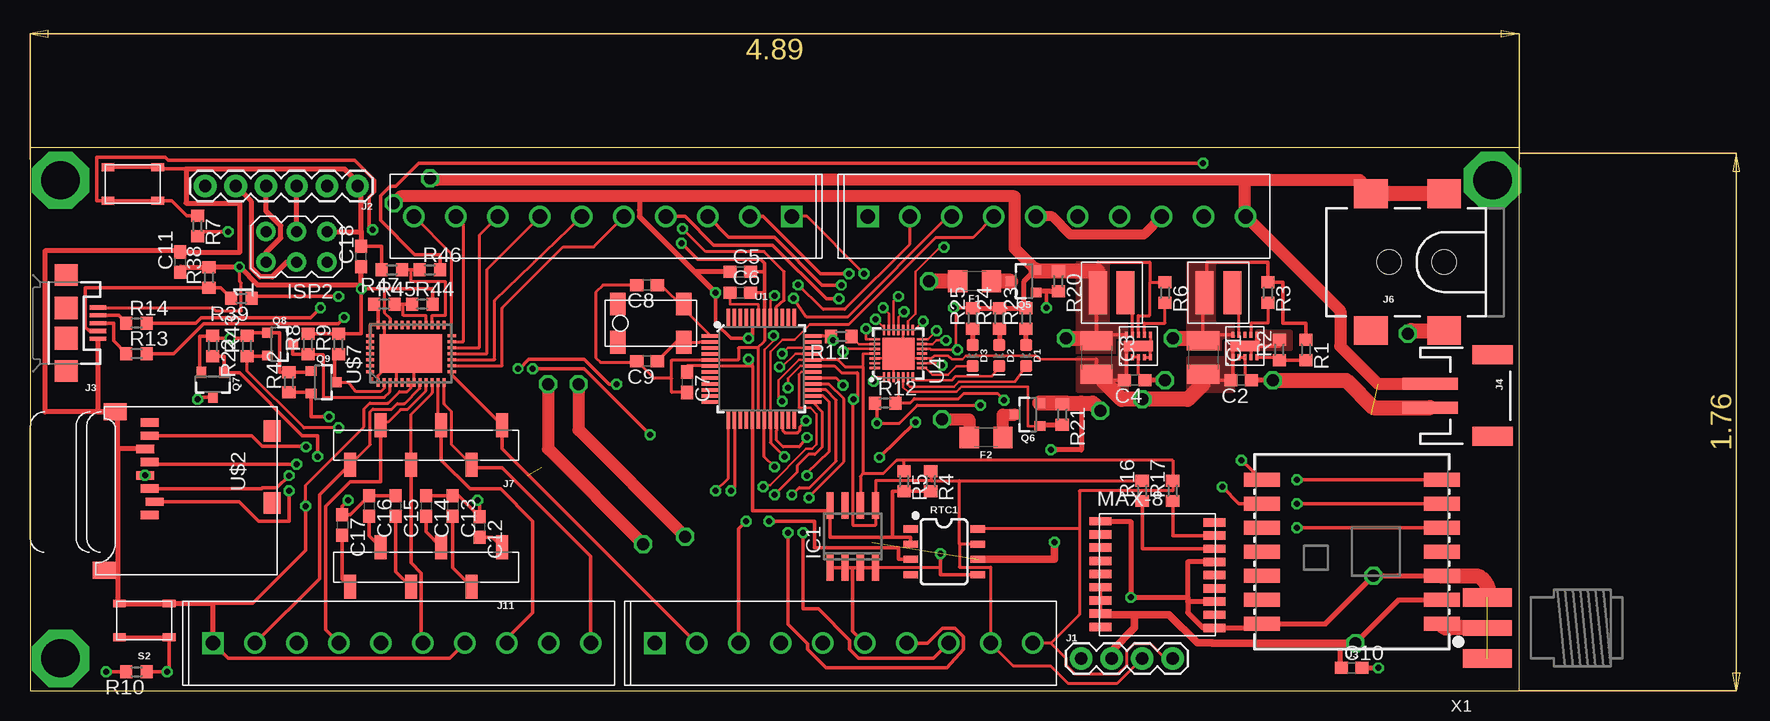
[diagram p7: board, top side]
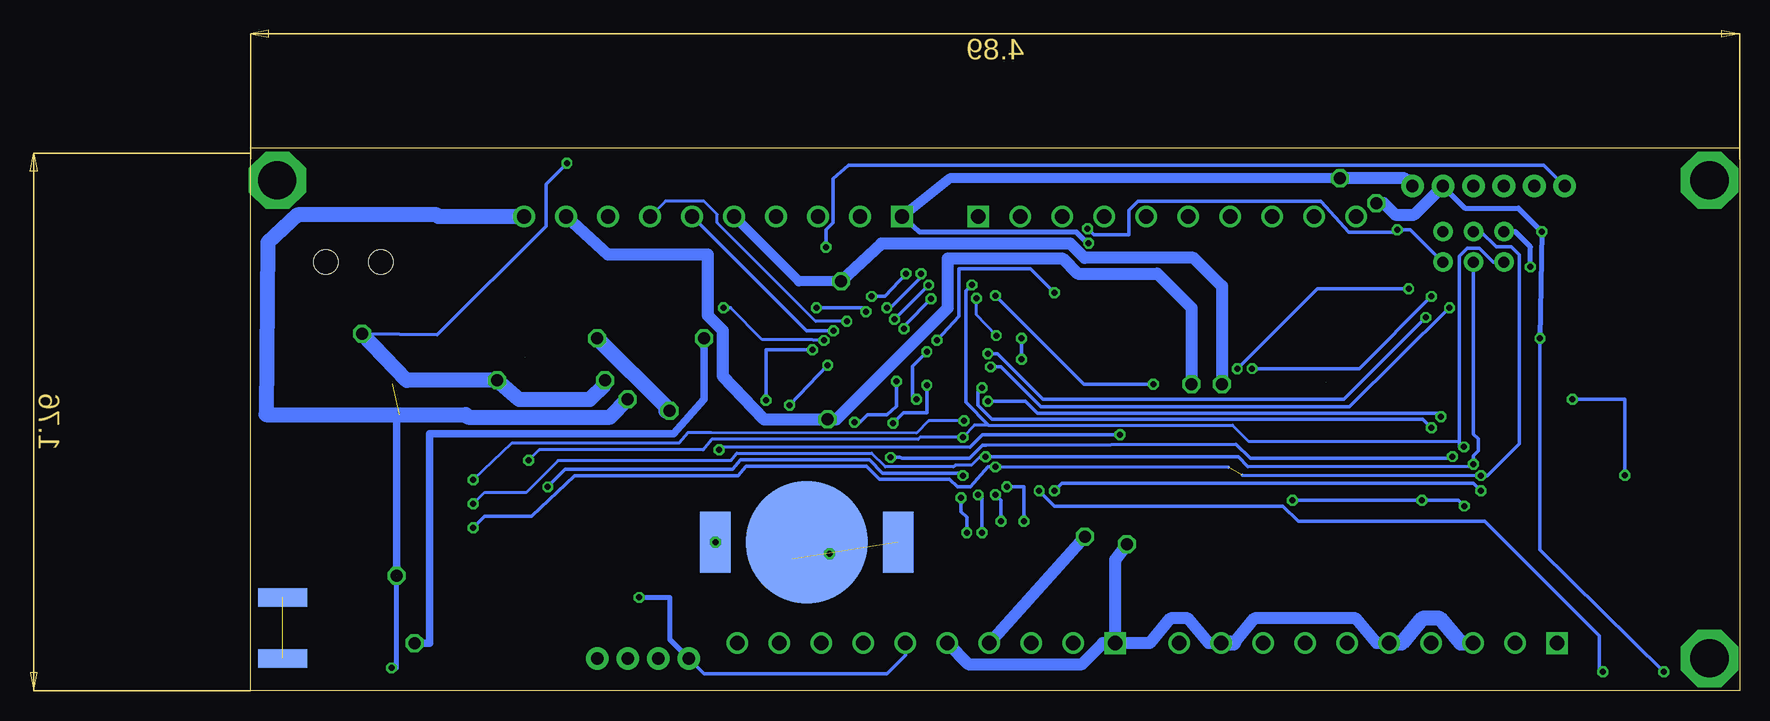
[diagram p8: board, bottom side, seen from below]

Size 124.13 x 45.27 mm. Coordinates in mm from the lower left corner, seen from the top.
Outline: 0,0 124.13,0 124.13,45.27 0,45.27 0,0
Copper layers (1*16): Top 0.0178mm / dielectric 59mil / Bottom 0.0178mm
Design rules "SSC-EAGLE-2Lyr_v1.0.0.3 *": minimum track width 8mil, minimum drill 14mil, track to track 8mil, track to pad 8mil, pad to pad 8mil, via to via 8mil, smd to smd 8mil, copper to edge 20mil, drill to drill 16mil, minimum pad ring 8mil, minimum via ring 8mil, stop-mask expansion 2.5mil, vias tented up to drill 0mil, thermal gap 10mil

### Footprints (pad centres in the part's own frame; a part is rotated, then mirrored left to right if it is on the bottom)
LINX_BAT-HLD-012-SMT = smd 10.16 x 10.16: GND 0,0 | smd 2.54 x 5.08: POWER0 -7.62,0; POWER1 7.62,0
C1210 = smd 1.6 x 2.7: 1 -1.4,0; 2 1.4,0
C0603 = smd 1.1 x 1: 1 -0.85,0; 2 0.85,0
LED-0603 = smd 1 x 1: A -0.877,0; C 0.877,0
1206 = smd 1.6 x 1.8: 1 -1.4,0; 2 1.4,0
SO-08 = smd 0.6 x 2.2: 1 -1.905,-2.6; 2 -0.635,-2.6; 3 0.635,-2.6; 4 1.905,-2.6; 5 1.905,2.6; 6 0.635,2.6; 7 -0.635,2.6; 8 -1.905,2.6
AVRISP = drill 0.9 pad 1.626: 1 -1.27,2.54; 2 1.27,2.54; 3 -1.27,0; 4 1.27,0; 5 -1.27,-2.54; 6 1.27,-2.54
1X04 = drill 1.016 pad 1.88: 1 0,0; 2 2.54,0; 3 5.08,0; 4 7.62,0
1X06 = drill 1.016 pad 1.88: 1 0,0; 2 2.54,0; 3 5.08,0; 4 7.62,0; 5 10.16,0; 6 12.7,0
USB-MICROB = smd 1.4 x 0.35: D+ -2.65,0; D- -2.65,-0.65; GND -2.65,1.3; ID -2.65,0.65; VBUS -2.65,-1.3 | smd 1.9 x 1.8: MT1 0,-4; MT2 0,4 | smd 1.9 x 1.9: P$1 0,-1.27; P$2 0,1.27
JST-2-SMD = smd 1 x 4.6: 1 -1,-3.7; 2 1,-3.7 | smd 1.6 x 3.4: NC1 -3.4,1.5; NC2 3.4,1.5
SCREWTERMINAL-3.5MM-10 = drill 1.2 square: P$1 0,0 | drill 1.2: P$2 3.5,0; P$3 7,0; P$4 10.5,0; P$5 14,0; P$6 17.5,0; P$7 21,0; P$8 24.5,0; P$9 28,0; P$10 31.5,0
POWER_JACK_SMD = smd 2.8 x 2.4: GND 0,-5.7; P$4 6.1,-5.7; VIN0 0,5.7; VIN1 6.1,5.7 | hole 2.032: 0,0; 4.572,0
1X06_SMD_STRAIGHT = smd 1 x 2: 1 0,1.65; 2 -2.54,-1.65; 3 -5.08,1.65; 4 -7.62,-1.65; 5 -10.16,1.65; 6 -12.7,-1.65
WE-LQS(INDUCTOR) = smd 1.5 x 3.6: P$1 -1.15,0; P$2 1.15,0
SOT23-3 = smd 0.8 x 0.9: 1 -0.95,-1; 2 0.95,-1; 3 0,1.1
R0603 = smd 1 x 1.1: 1 -0.85,0; 2 0.85,0
SO08 = smd 0.6 x 1.2: 1 -1.905,-2.8; 2 -0.635,-2.8; 3 0.635,-2.8; 4 1.905,-2.8; 5 1.905,2.8; 6 0.635,2.8; 7 -0.635,2.8; 8 -1.905,2.8
SKRPABE010_(SWITCH) = smd 1.05 x 0.65: P$1 -2.075,1.4; P$2 2.075,1.4; P$3 2.075,-1.4; P$4 -2.075,-1.4
TQFP-48 = smd 1.5 x 0.28: 1 -4.25,2.75; 2 -4.25,2.25; 3 -4.25,1.75; 4 -4.25,1.25; 5 -4.25,0.75; 6 -4.25,0.25; 7 -4.25,-0.25; 8 -4.25,-0.75; 9 -4.25,-1.25; 10 -4.25,-1.75; 11 -4.25,-2.25; 12 -4.25,-2.75; 25 4.25,-2.75; 26 4.25,-2.25; 27 4.25,-1.75; 28 4.25,-1.25; 29 4.25,-0.75; 30 4.25,-0.25; 31 4.25,0.25; 32 4.25,0.75; 33 4.25,1.25; 34 4.25,1.75; 35 4.25,2.25; 36 4.25,2.75 | smd 0.28 x 1.5: 13 -2.75,-4.25; 14 -2.25,-4.25; 15 -1.75,-4.25; 16 -1.25,-4.25; 17 -0.75,-4.25; 18 -0.25,-4.25; 19 0.25,-4.25; 20 0.75,-4.25; 21 1.25,-4.25; 22 1.75,-4.25; 23 2.25,-4.25; 24 2.75,-4.25; 37 2.75,4.25; 38 2.25,4.25; 39 1.75,4.25; 40 1.25,4.25; 41 0.75,4.25; 42 0.25,4.25; 43 -0.25,4.25; 44 -0.75,4.25; 45 -1.25,4.25; 46 -1.75,4.25; 47 -2.25,4.25; 48 -2.75,4.25
RFM69CW-XXXS2 = smd 3 x 1.2: 1 -7.5,6; 2 -7.5,4; 3 -7.5,2; 4 -7.5,0; 5 -7.5,-2; 6 -7.5,-4; 7 -7.5,-6; 8 7.5,-6; 9 7.5,-4; 10 7.5,-2; 11 7.5,0; 12 7.5,2; 13 7.5,4; 14 7.5,6
QFN-28 = smd 0.85 x 0.2: 1 -1.975,1.2; 2 -1.975,0.8; 3 -1.975,0.4; 4 -1.975,0; 5 -1.975,-0.4; 6 -1.975,-0.8; 7 -1.975,-1.2; 15 1.975,-1.2; 16 1.975,-0.8; 17 1.975,-0.4; 18 1.975,0; 19 1.975,0.4; 20 1.975,0.8; 21 1.975,1.2 | smd 0.2 x 0.85: 8 -1.2,-1.975; 9 -0.8,-1.975; 10 -0.4,-1.975; 11 0,-1.975; 12 0.4,-1.975; 13 0.8,-1.975; 14 1.2,-1.975; 22 1.2,1.975; 23 0.8,1.975; 24 0.4,1.975; 25 0,1.975; 26 -0.4,1.975; 27 -0.8,1.975; 28 -1.2,1.975 | smd 2.65 x 2.65: 29 0,0
MICROSD = smd 0.7 x 1.5: 1 9,-10.64; 2 7.9,-10.24; 3 6.8,-10.64; 4 5.7,-11.04; 5 4.6,-10.64; 6 3.5,-11.04; 7 2.4,-10.64; 8 1.3,-10.64 | smd 1.8 x 1.4: CD1 2,-0.44; CD2 8,-0.44 | smd 1.4 x 1.9: MT1 0.4,-13.54; MT2 13.6,-14.44
WSON-10 = smd 0.5 x 0.25: P$1 -0.95,1; P$2 -0.95,0.5; P$3 -0.95,0; P$4 -0.95,-0.5; P$5 -0.95,-1; P$6 0.95,-1; P$7 0.95,-0.5; P$8 0.95,0; P$9 0.95,0.5; P$10 0.95,1 | smd 0.84 x 2.4: P$11 0,0
4-SOJ = smd 1.3 x 1.9: P$1 -2.75,1.6; P$2 2.75,1.6; P$3 2.75,-1.6; P$4 -2.75,-1.6
MAX-8 = smd 1.8 x 0.7: P$1 -4.75,4.445; P$2 -4.75,3.345; P$3 -4.75,2.245; P$4 -4.75,1.145; P$5 -4.75,0.045; P$6 -4.75,-1.055; P$7 -4.75,-2.155; P$8 -4.75,-3.255; P$9 -4.75,-4.355; P$10 4.75,-4.445; P$11 4.75,-3.345; P$12 4.75,-2.245; P$13 4.75,-1.145; P$14 4.75,-0.045; P$15 4.75,1.055; P$16 4.75,2.155; P$17 4.75,3.255; P$18 4.75,4.355
QFN38-5X7 = smd 0.7 x 0.25: 1 -2.4,2.75; 2 -2.4,2.25; 3 -2.4,1.75; 4 -2.4,1.25; 5 -2.4,0.75; 6 -2.4,0.25; 7 -2.4,-0.25; 8 -2.4,-0.75; 9 -2.4,-1.25; 10 -2.4,-1.75; 11 -2.4,-2.25; 12 -2.4,-2.75; 20 2.4,-2.75; 21 2.4,-2.25; 22 2.4,-1.75; 23 2.4,-1.25; 24 2.4,-0.75; 25 2.4,-0.25; 26 2.4,0.25; 27 2.4,0.75; 28 2.4,1.25; 29 2.4,1.75; 30 2.4,2.25; 31 2.4,2.75 | smd 0.25 x 0.7: 13 -1.5,-3.4; 14 -1,-3.4; 15 -0.5,-3.4; 16 0,-3.4; 17 0.5,-3.4; 18 1,-3.4; 19 1.5,-3.4; 32 1.5,3.4; 33 1,3.4; 34 0.5,3.4; 35 0,3.4; 36 -0.5,3.4; 37 -1,3.4; 38 -1.5,3.4 | smd 3.2 x 5.2: EXP 0,0
SMA_EDGELAUNCH = smd 4.064 x 1.524: GND@1 2.032,-2.54; GND@2 2.032,2.54 | smd 4.064 x 1.524 bottom: GND@3 2.032,2.54; GND@4 2.032,-2.54 | smd 4.064 x 1.27: P 2.032,0

### Placement (x,y rotation side)
BT1  77.79,12.38 0 bottom
C1  97.79,27.78 270 top
C2  100.97,25.88 180 top
C3  88.9,27.78 270 top
C4  92.08,25.88 180 top
C5  59.21,34.93 0 top
C6  59.21,33.18 0 top
C7  54.77,25.72 270 top
C8  51.43,33.81 180 top
C9  51.43,27.46 180 top
C10  110.17,1.91 0 top
C11  12.54,35.72 90 top
C12  37.46,13.65 270 top
C13  35.24,15.4 270 top
C14  33.02,15.4 270 top
C15  30.48,15.4 270 top
C16  28.26,15.4 270 top
C17  26.03,13.81 270 top
C18  27.62,36.2 90 top
D1  83.03,27.94 270 top
D2  80.8,27.94 270 top
D3  78.58,27.94 270 top
F1  78.74,34.13 180 top
F2  79.69,21.11 180 top
IC1  68.58,12.86 0 top
ISP2  22.23,36.99 90 top
J1  87.63,2.7 0 top
J2  27.3,42.07 180 top
J3  3.02,30.64 180 top
J4  120.41,24.61 270 top
J5  63.5,39.53 180 top
J6  117.87,35.72 180 top
J7  26.67,20.48 180 top
J8  15.24,3.97 0 top
J9  52.07,3.97 0 top
J10  69.85,39.53 0 top
J11  26.67,10.32 180 top
L1  99.06,33.18 180 top
L2  90.17,33.18 180 top
Q5  82.87,34.13 90 top
Q6  83.19,23.02 90 top
Q7  15.24,25.56 180 top
Q8  20.8,28.89 270 top
Q9  24.45,25.72 270 top
R1  106.36,28.42 270 top
R2  104.14,28.42 90 top
R3  103.19,33.18 270 top
R4  75.09,17.46 270 top
R5  72.87,17.46 270 top
R6  94.61,33.18 270 top
R7  13.97,38.74 270 top
R8  23.18,28.89 90 top
R9  25.72,28.89 90 top
R10  8.89,1.59 180 top
R11  67.63,29.53 180 top
R12  71.28,23.97 0 top
R13  8.89,28.1 0 top
R14  8.89,30.64 0 top
R16  92.71,16.67 90 top
R17  95.25,16.67 90 top
R20  85.72,34.13 270 top
R21  86.04,23.02 270 top
R22  15.24,28.73 270 top
R23  83.03,31.04 90 top
R24  80.8,31.04 90 top
R25  78.58,31.04 90 top
R38  14.92,34.45 90 top
R39  17.62,32.7 180 top
R42  21.59,25.72 90 top
R43  18.1,28.73 90 top
R44  32.7,32.23 0 top
R45  29.53,32.23 0 top
R46  33.34,35.08 0 top
R47  30.16,35.08 180 top
RTC1  76.2,11.59 270 top
S2  9.53,5.87 180 top
U1  60.96,26.83 0 top
U3  110.17,11.59 180 top
U4  72.39,28.1 90 top
U$1  8.57,42.23 0 top
U$2  20.64,23.65 270 top
U$3  101.28,28.73 90 top
U$4  92.39,28.73 90 top
U$5  51.75,30.64 180 top
U$6  93.98,9.68 0 top
U$7  31.75,28.1 90 top
X1  123.51,5.24 180 top

### Tracks (layer width: path | path; a pad name or v marks a point on that pad's centre or on a via)
3.3V  (via drill 0.5, 1)  (1 unrouted)
  Top 0.203: U4.18 72.39,31.11 v72.87,31.59 | U4.4 72.39,23.97 | v77.31,28.42 77.17,28.43 77.17,31.89 | 77.31,28.5 v77.31,28.42 | U4.12 75.01,28.5 75.09,28.42 v77.31,28.42
  Top 0.254: 93.34,34.03 93.34,31.27 92.39,31.27 U$4.P$8 | 93.34,34.03 R6.1 | 89.02,35.72 93.34,35.72 93.34,34.03 | U1.6 | 60.21,27.08 U1.17 | 60.21,27.08 60.21,27.62 | U1.6 60.21,27.08 | U1.6 54.77,27.08 C7.1 | 72.39,23.97 73.34,23.97 73.71,24.34 77.41,24.34 77.85,24.78 80.65,24.78 v81.2,24.21
  Top 0.305: U$4.P$10 89.4,29.68 C3.1 88.9,29.37 88.9,33.18 L2.P$2 89.02,34.45 89.02,35.72 | RTC1.2 73.4,12.78 71.91,12.78 | 71.91,12.78 66.67,12.78 66.67,15 | 66.67,15 IC1.8 | 60.21,30.85 U1.44 60.21,29.69 v59.89,29.37 58.42,29.37 57.15,30.64 v57.15,33.18 | U$6.P$6 U$6.P$7 U$6.P$8 | 60.21,27.62 v59.89,27.62 | Q9.1 23.45,26.57 R42.2 20.8,26.57 20.8,29.84 Q8.1 18.1,29.84 R43.2 18.1,29.37 v16.67,29.37 15.24,29.37 R22.1 15.24,29.53 14.13,29.53 14.13,26.56 Q7.2 | R4.2 R5.2 71.91,16.61 71.91,12.78 | R10.2 v6.35,1.59 | R25.2 78.32,31.91 v76.99,31.91 77.17,31.89 | v66.94,29.21 R11.2 66.11,29.57 U1.36 | 72.39,23.97 R12.2 | v16.51,38.26 14.19,38.26 R7.2 | 66.67,15 60.21,15 U1.17
  Top 0.406: v110.49,3.97 114.11,7.59 U3.2 | 50.8,41.21 50.8,40.08 50.81,40.07 50.81,39.52 55.4,34.92 | 55.4,34.92 v57.15,33.18 | C5.1 55.4,34.92 | R24.2 R25.2 R23.2 82.87,31.81 82.87,34.13 83.82,35.08 Q5.2 | C10.1 109.22,2.01 109.22,3.97
  Top 0.61: v110.49,3.97 109.22,3.97 98.57,3.97 98.55,3.99 97.3,3.99 94.93,6.35 92.08,6.35 | 92.08,6.35 89.31,6.35 U$6.P$8 | J1.2 90.17,3.33 92.08,5.24 92.08,6.35
  Top 1.016: Q5.2 82.07,36.88 82.07,41.21 50.8,41.21 30.89,41.21 v30.32,40.64
  Top 1.27: v86.36,29.37 88.9,29.37 | 89.02,34.45 89.02,34.98 R20.1 83.87,34.98 Q5.2
  Bottom 0.305: v59.89,29.37 v59.89,27.62 | J2.2 | v6.35,1.59 16.67,11.75 v16.67,29.37 | v72.87,31.59 73.18,31.91 v76.99,31.91 | v81.2,24.21 81.2,28.42 v77.31,28.42 | v66.94,29.21 65.09,31.22 65.09,35.16 59.13,35.16 v57.15,33.18
  Bottom 0.406: J2.2 22.92,40.22 18.47,40.22 v16.51,38.26 v16.67,29.37
  Bottom 0.61: v110.49,3.97 109.22,3.97 109.22,21.43 88.9,21.43 86.36,24.29 v86.36,29.37
  Bottom 1.016: v30.32,40.64 29.69,40.64 28.73,39.69 27.15,39.69 J2.2
  pour Top (rank 2, no thermals): 90.17,28.1 87.31,28.1 87.31,35.72 89.85,35.72 89.85,30.64 91.44,30.64 91.44,28.1
3.3V_EXT_CTRL  (via drill 0.5)
  Top 0.203: U4.13 75.24,28.9 75.56,29.21 75.87,29.21 v76.36,29.2
  Top 0.305: v84.73,31.91 84.73,33.28 85.09,33.28
  Top 0.406: R20.2 85.09,33.28 83.87,33.28 Q5.1
  Bottom 0.254: 84.14,31.91 81.5,29.27 77.47,29.27 77.33,29.27 76.36,29.27 v76.36,29.2
  Bottom 0.305: 84.14,31.91 v84.73,31.91
5V  (via drill 0.5, 1)
  Top 0.254: 29.53,33.5 29.53,31.51 30,31.04 U$7.29 U$7.28 | v17.46,35.32 17.46,34.13 17.62,33.97 17.62,31.67 15.48,31.67 15.21,31.94 J3.VBUS
  Top 0.305: R1.1 106.36,30.64 104.46,30.64 104.46,34.03 R3.1 103.19,35.72 98.11,35.72 98.11,33.18 L1.P$2 97.79,33.18 97.79,29.37 C1.1 98.29,29.68 U$3.P$10 | R44.2 33.55,33.5 29.53,33.5 v27.62,33.5 27.62,29.74 R9.2 R8.2 | v41.91,26.83 46.2,26.83 v51.67,21.35
  Top 0.406: R21.1 arc-90 86.14,23.97 86.36,23.97 | C11.1 12.59,35.3 R38.2 15.24,35.32 v17.46,35.32 18.97,33.81 27.3,33.81 v27.62,33.5 C18.1 | 87.63,23.97 87.63,20.08 v85.09,20.08
  Top 1.27: v95.25,29.37 97.79,29.37 | v89.22,23.34 88.58,23.97 87.63,23.97 86.36,23.97 Q6.2
  Bottom 0.305: v27.62,33.5 35.24,33.5 v41.91,26.83 | 85.09,20.32 64.2,20.3 63.14,21.35 62.95,21.35 v51.67,21.35
  Bottom 0.406: ISP2.2 18.73,38.26 17.46,36.99 v17.46,35.32 | v85.09,20.08 85.09,20.32
  Bottom 1.27: v95.25,29.37 89.53,23.65 89.53,23.34 v89.22,23.34
  pour Top (rank 2, no thermals): 100.33,28.42 96.52,28.42 96.52,35.72 98.74,35.72 98.74,30.64 100.33,30.64
5V_EXT_CTRL
  Top 0.203: U4.5 72.79,25.32 73.18,24.92 77.23,24.92 77.47,25.16 77.63,25.32 | Q6.1 83.19,22.07 83.19,25.32 77.63,25.32 | 77.63,25.32 | 77.63,25.32 | 77.63,25.32
  Top 0.305: Q6.1
  Top 0.406: Q6.1 arc-90 84.28,22.17 R21.2
ADC0
  Top 0.254: J7.1 28.35,20.51 28.35,23.28 28.56,23.48 30.16,23.48 30.62,23.94 31.22,23.94 32.48,25.2 32.48,25.68 U$7.8
  Top 0.305: J8.P$2 24.13,9.36 24.13,16.35 26.67,18.89 J7.1
ADC1
  Top 0.254: U$7.9 33.01,25.01 31.43,23.43 30.89,23.43 29.84,22.38 29.47,22.38 J7.2
  Top 0.305: J8.P$4 24.64,5.07 24.64,15.4 26.67,17.43 29.21,17.43 J7.2 29.47,22.38
ADC2
  Top 0.254: J7.3 31.75,23.03 33.52,24.8 33.52,25.46 33.5,25.48 U$7.10
  Top 0.305: J7.3 31.75,10.67 32.61,9.82 32.61,4.1 J8.P$6
ADC3
  Top 0.254: 34,22.42 U$7.11
  Top 0.305: 34,22.42 arc90 J7.4 34.29,19.21 36.67,16.83 39.21,16.83 41.91,14.13 41.91,6.51 39.74,4.34 J8.P$8
ADC4  (1 unrouted)
  Top 0.254: 34.53,25.7 34.53,23.89 35.15,23.28 35.15,20.51 J7.5
  Top 0.305: J8.P$10 46.74,11.2 39.37,18.57 37.09,18.57 J7.5
ADC5
  Top 0.305: U$7.13 35.15,26.35 J7.6 39.37,20.17 J9.P$2
ADC6
  Top 0.254: U$7.14 39.37,27.1 39.37,31.91 44.45,36.99 46.99,36.99 46.99,37.02 J5.P$5
  Top 0.406: J5.P$5 49.5,39.5
ADC7
  Top 0.254: U$7.15 38.73,27.6 38.73,32.54 J5.P$6
ADC8
  Top 0.254: U$7.16 38.1,28.1 38.1,35.13 J5.P$7
ADC9
  Top 0.254: U$7.17 37.46,28.6 37.46,37.99 J5.P$8
ADC10
  Top 0.254: U$7.18 36.13,29.1 36.13,38.89 J5.P$9
ADC11
  Top 0.254: U$7.19 35.15,36.38 J5.P$10
BATT+  (via drill 0.5, 1)  (1 unrouted)
  Top 0.254: U$4.P$2 U$4.P$3 92.39,26.41 C4.1 | C2.1 101.27,26.42 U$3.P$3 U$3.P$2
  Top 0.305: 92.71,25.88 C4.1 | v97.79,43.97 32.38,43.97 30.48,42.07 30,42.07 29.21,41.27 29.21,39.21 32.07,36.35 34.19,36.35 R46.2
  Top 0.406: v103.58,25.88 C2.1 | v94.61,25.88 92.71,25.88
  Top 1.27: v103.58,25.88 109.72,25.88 111.99,23.61 J4.2 | v114.86,29.77 115.11,30.02 J6.VIN0
  Bottom 0.305: v114.86,29.77 108.59,29.69 99.54,38.73 99.54,42.23 v97.79,43.97
  Bottom 1.27: v94.61,25.88 94.61,25.56 95.89,24.29 101.76,24.29 v103.58,25.88 111.13,25.88 v114.86,29.77
EXT_3.3V  (via drill 1)
  Top 0.813: 77.58,34.13 F1.2 | J10.P$8 92.84,38.02 86.72,38.02 85.22,39.53 J10.P$5
  Top 1.016: v43.18,25.56 43.18,20.16 v51.12,12.22
  Top 1.27: F1.2 v74.93,34.13
  Bottom 0.813: 74.95,34.13 78.45,34.13 J10.P$5
  Bottom 1.016: v74.93,34.13 74.95,34.13 71.57,37.27 55.82,37.27 54.63,36.08 45.55,36.08 43.18,33.72 v43.18,25.56 | v51.12,12.22 52.07,10.96 J9.P$1 | J8.P$5 30.28,3.97 32.02,6.04 40.46,6.04 42.2,3.97 | J8.P$9 44.28,3.97 46.02,6.04 47.46,6.04 49.2,3.97 J9.P$1 | J9.P$5 64.33,2.23 54.85,2.23 53.11,3.97 J9.P$1
  Bottom 1.27: J8.P$3 23.28,3.97 25.02,6.04 26.46,6.04 28.2,3.97 J8.P$5 | 42.2,3.97 J8.P$9
EXT_5V  (via drill 1)
  Top 1.016: v45.72,25.56 45.72,21.75 v54.61,12.86 | v76.04,22.62 78.29,22.62 F2.2
  Bottom 1.016: v45.72,25.56 45.72,31.91 48.58,34.77 55.22,34.77 56.49,36.04 66.04,36.04 66.04,31.91 75.33,22.62 v76.04,22.62 81.34,22.62 84.77,26.22 84.77,30.03 86.02,31.27 86.02,36.35 94.36,36.35 J10.P$9 | J9.P$4 v54.61,12.86
EXT_D6  (via drill 0.5)
  Top 0.203: U4.15 73.73,30.07 v74.45,30.8
  Bottom 0.254: v74.45,30.8 77.05,30.8 85.26,39.01 85.26,39.7 86.36,40.8 89.58,40.8 J10.P$7
EXT_INT  (via drill 0.5)
  Top 0.203: 64.77,26.57 64.31,26.57 64.1,26.37 64.1,23.58 65.06,23.58 65.57,23.07 65.57,20.56 65.17,20.16 64.71,20.16 61.67,17.13 61.25,17.13 v61.12,17
  Top 0.254: 65,26.57 64.77,26.57 64.77,26.58 U1.30
  Top 0.305: J9.P$3 59.07,13.51 v59.69,14.13
  Bottom 0.305: v59.69,14.13 59.69,16.99 61.1,16.99 v61.12,17
GND  (via drill 0.5, 1)  (5 unrouted)
  Top 0.203: U4.26 71.99,27.7 U4.3 | 72.79,27.7 U4.10 75.16,27.7 75.41,27.94 76.52,27.94 76.83,27.62 77.71,27.62 78.03,27.94 83.86,27.94 84.18,27.62 88.9,27.62 | U4.17 72.79,28.5
  Top 0.254: U$4.P$6 93.39,28.73 U$4.P$5 U$4.P$4 | 101.78,28.73 U$3.P$4 | 31.75,25.7 U$7.6 | 31.75,25.7 U$7.7 32,27.85 | 30.5,26.81 U$7.4 | U$7.1 29,26.27 30.83,28.1 | U$7.30 29.5,28.1 | C8.2 47.77,33.81 47.15,33.2 47.15,27.76 47.55,27.36 50.68,27.36 | 70.48,10.32 75.88,10.32 | 53.5,26.04 53.5,27.58 U1.5 59.05,27.58 59.05,28.57 60.64,28.57 | 53.5,26.04 52.01,26.04 C9.2 | U1.42 61.21,29.14 60.64,28.57 | U1.18 60.71,28.51 60.64,28.57 | v22.99,15.4 22.99,17.15 27.85,22.01 27.85,23.49 28.33,23.97 29.84,23.97 30.8,24.92 31.43,24.92 31.75,25.24 31.75,25.7 | C7.2 53.5,24.87 53.5,26.04
  Top 0.305: 93.39,28.73 U$4.P$11 91.39,28.73 U$4.P$1 91.39,26.35 C4.2 89.41,25.88 C3.2 88.9,27.62 | U$3.P$11 101.78,28.73 | U$3.P$11 100.28,28.73 U$3.P$1 100.28,26.04 arc-90 C2.2 97.79,25.88 C1.2 | 102.28,28.73 U$3.P$6 | 102.28,28.73 U$3.P$11 | R2.2 104.14,28.73 102.28,28.73 | 30.5,26.81 30.48,26.83 U$7.EXP | 32,27.85 U$7.EXP | 30.83,28.1 U$7.EXP | U$7.31 U$7.30 | U$7.31 28.35,30.5 U$7.32 U$7.33 U$7.34 | 29.5,28.1 U$7.EXP | IC1.1 IC1.2 68.58,10.26 | 68.58,10.26 IC1.3 IC1.4 70.48,10.32 | U$2.MT2 7.3,10.05 | 7.3,23.02 7.1,23.02 U$2.MT1 | RTC1.5 75.88,9.68 75.88,10.32 v75.88,11.43 | R45.1 29,31.9 U$7.31 | J9.P$6 68.58,4.96 68.58,10.26 | J8.P$7 34.97,2.7 16.51,2.7 J8.P$1 | v22.99,15.4 22.99,11.72 18.57,7.3 15.24,7.3 | C15.1 C16.1 26.67,14.66 C17.1 26.03,15.4 v26.51,15.88 | C14.1 C13.1 35.72,16.25 C12.1 37.46,15.72 v37.31,15.88 | 61.21,33.18 61.21,34.92 | 61.21,33.18 U1.42 | 61.21,34.92 61.21,35.63 60.88,35.96 55.64,35.96 v54.29,37.31 | C5.2 61.21,34.92 | C6.2 61.21,33.18 | U4.29 72.39,27.7 71.99,27.7 U4.29 | 72.79,27.7 U4.29 | 72.79,28.5 U4.29 | R47.2 29.31,37.05 C18.2 | U$1.P$1 U$1.P$2 10.65,43.5 13.02,43.5
  Top 0.406: 102.64,5.24 U3.14 | U$6.P$12 96.52,7.44 | U$6.P$15 96.52,10.74 96.52,7.78 | 96.52,7.78 96.52,7.44 | 96.52,7.78 v91.76,7.78 91.76,14.13 U$6.P$1 | 7.3,20.15 7.3,10.05 7.3,7.27 S2.P$3 S2.P$4 11.79,7.3 15.24,7.3 J8.P$1 | 7.3,20.15 7.3,23.02 | U$2.6 7.3,20.15 | C9.2 50.68,27.36 | 96.52,7.44 96.52,6.51 97.79,5.24 U$6.P$10 102.64,5.24 | J3.GND 5.67,23.25 U$2.MT1 1.27,23.25 1.27,36.67 12.54,36.67 C11.2 12.54,36.51 17.46,36.51 17.46,40.64 13.02,40.64 13.02,43.5 26.19,43.5 27.3,42.39 J2.1 27.62,42.07 27.62,38.26 | 102.64,5.24 arc90 U3.14 | U3.14 107.98,5.59 111.98,9.59 U3.3 | C10.2 v112.39,1.91 | 27.62,38.26 C18.2 | ISP2.6 27.62,38.26
  Top 1.016: v33.34,42.7 33.93,42.58 101.28,42.58 | J6.P$4 110.84,42.58 101.28,42.58 | 101.28,42.58 101.28,39.6 J10.P$10 109.22,31.66 109.22,28.73 112.35,25.61 J4.1
  Top 1.27: C1.2 97.79,25.56 96.52,24.29 v92.71,24.29 90.99,24.29 89.41,25.88 | U3.3 120.62,9.59 arc-90 X1.GND@1 | J6.GND J6.P$4
  Bottom 0.305: J1.1 86.36,1.43 71.12,1.43 69.57,2.98 J9.P$6 | v22.99,15.4 23.46,15.88 v26.51,15.88 v37.31,15.88 | v75.88,11.43 77.79,11.43 BT1.GND
  Bottom 0.406: v91.76,7.78 89.22,7.78 89.22,4.29 J1.1 | v54.29,37.31 54.39,37.31 55.3,38.22 68.38,38.22 J10.P$1 | v112.39,1.91 111.98,1.91 111.98,10.32
  Bottom 0.61: 111.76,23.02 111.98,22.8 111.98,10.32 111.98,9.59
  Bottom 0.813: v33.34,42.7 65.88,42.7 J10.P$1
  Bottom 1.016: v33.34,42.7 27.94,42.7 J2.1
  Bottom 1.27: v92.71,24.29 94.18,22.82 106.02,22.82 106.22,23.02 122.87,23.02 122.71,37.35 120.25,39.66 108.62,39.66 108.5,39.53 J10.P$10
  pour Top (no thermals): 87.31,27.78 90.8,27.78 90.8,29.05 91.44,29.05 91.44,24.92 87.31,24.92
  pour Top (no thermals): 96.52,27.78 99.69,27.78 99.69,29.05 102.23,29.05 102.23,30 105.09,30 105.09,28.42 100.33,28.42 100.33,24.92 96.52,24.92
GPIO_EXT1  (via drill 0.5)
  Top 0.203: U4.19 71.99,32.46 v72.39,32.86
  Top 0.254: v69.53,34.77 64.77,39.53 J5.P$1
  Bottom 0.305: v72.39,32.86 71.28,32.86 v69.53,34.77
GPIO_EXT2  (via drill 0.5)
  Top 0.203: U4.20 71.59,31.44 v71.12,31.91
  Top 0.305: v68.26,34.77 65.88,34.77 61.12,39.53 J5.P$2
  Bottom 0.305: v71.12,31.91 70.8,31.91 68.26,34.45 v68.26,34.77
GPIO_EXT3  (via drill 0.5)
  Top 0.203: U4.21 71.19,30.25 v70.48,30.96
  Top 0.305: v67.63,33.81 66.04,33.81 62.07,37.78 58.25,37.78 J5.P$3
  Bottom 0.305: v70.48,30.96 v67.63,33.81
GPIO_EXT4  (via drill 0.5)
  Top 0.203: U4.22 69.69,29.3 v69.69,30.16
  Top 0.305: v67.43,32.66 66.4,32.66 61.91,37.15 56.99,37.15 54.61,39.53 J5.P$4
  Bottom 0.305: v69.69,30.16 69.61,30.48 v67.43,32.66
LED1
  Top 0.203: D1.C 82.1,25.74 77.43,25.74 77.03,25.34 73.34,25.34 73.19,25.5 U4.6
LED2
  Top 0.203: U4.7 73.59,26.11 73.82,25.88 76.2,25.88 | D2.C 80.17,26.19 77.16,26.19 76.84,25.88 76.2,25.88 | 76.2,25.88 76.67,25.88
LED3
  Top 0.203: U4.8 74.7,26.9 75.25,26.35 76.5,26.35 77.22,27.07 D3.C
  Top 0.305: D3.C 78.43,26.9
MISO  (via drill 0.5)
  Top 0.254: U1.21 62.21,21.68 62.23,20.87 62.78,20.32 64.14,20.32 v64.77,21.11 | J10.P$2 73.35,37.22 67.91,31.78 66.11,31.78 63.99,33.9 v64.03,33.82
  Top 0.305: U3.8 v100.97,19.21 | U$2.7 18.49,21.25 19.35,20.4 22.94,20.4 v23.02,20.32
  Top 0.406: ISP2.1 19.69,36.53 20.9,37.75 20.9,38.76 19.69,39.98 J2.4
  Bottom 0.254: v100.97,19.21 100.1,20.08 86.45,20.08 85.74,20.95 68.51,20.95 68.36,21.11 v64.77,21.11 63.82,22.15 62.63,22.15 42.31,22.15 40.96,20.8 23.39,20.8
  Bottom 0.305: ISP2.1 20.57,35.72 21.74,36.89 22.71,36.89 23.39,36.2 23.39,20.8 23.39,20.32 v23.02,20.32 | 62.63,22.15 64.53,24.05 64.53,33.34 64.27,33.6 v64.03,33.82
MOSI  (via drill 0.5, 0.5 pad 0.2)  (1 unrouted)
  Top 0.203: v61.99,29.61 61.99,29.18 61.23,28.42 61.23,22.6 U1.19
  Top 0.254: v62.06,18.65 61.2,19.52 U1.19 arc-90 U1.19 | J10.P$3 76.53,39.53 68.19,31.19 64.7,31.19 v63.66,32.7
  Top 0.305: v105.59,13.59 U3.5 | v21.59,17.94 20.56,16.91 19.35,16.91 19.3,16.85 U$2.3
  Top 0.406: ISP2.4 J2.3
  Bottom 0.254: v61.99,29.61 63.66,31.35 v63.66,32.7
  Bottom 0.305: v105.59,13.59 104.64,14.54 100.71,14.54 97.16,17.94 83.53,17.94 82.84,18.73 72.82,18.73 71.71,17.62 65.88,17.62 65.25,16.99 64.14,16.99 62.71,18.65 v62.06,18.65 42.63,18.62 | ISP2.4 21.59,38.26 20.32,36.99 19.05,36.99 18.41,36.35 18.41,20.58 21.06,17.94 v21.59,17.94 41.46,17.98
MUX_INT  (via drill 0.5)
  Top 0.203: U4.9 75.88,27.3 v76.04,27.15
  Top 0.254: U1.29 67.19,26.08 v67.79,25.48 | v79.22,23.81 73.98,23.81 72.47,22.3 v70.59,22.3
  Top 0.305: R12.1 70.59,23.97 v70.59,22.3
  Bottom 0.305: v67.79,25.48 67.79,23.18 69.71,23.18 v70.59,22.3 | v79.22,23.81 v76.04,27.15
N$1
  Top 0.254: U$3.P$9 100.78,32.61
  Top 0.305: 100.78,32.61 L1.P$1
N$2
  Top 0.254: U$4.P$9 91.89,32.96
  Top 0.305: 91.89,32.96 91.89,32.97 91.89,33.18 L2.P$1
N$3
  Top 0.254: 103.92,27.78 102.87,27.78 U$3.P$5
  Top 0.305: 103.92,27.78 R2.1 R1.2
N$4
  Top 0.254: R3.2 103.19,30.64 101.78,30.64 U$3.P$7
N$5  (via drill 0.5)
  Top 0.254: U1.14 58.71,16.96 v58.42,16.67
  Top 0.305: v11.43,1.59 R10.1 | v11.43,1.59 11.68,1.59 | v11.43,1.59 11.6,1.76 S2.P$1 S2.P$2
  Bottom 0.305: v58.42,16.67 57.15,15.4 38.1,15.4 36.83,14.13 21.27,14.13 11.75,4.6 11.75,1.59 v11.43,1.59
N$6
  Top 0.254: U$4.P$7 92.89,30.64 94.61,30.64 R6.2
N$7  (via drill 3.17)
  other vias: 121.92,42.55
N$8
  Top 0.203: C6.1 58.36,32.23 60.64,32.23 arc-90 60.71,32.16 U1.43
N$9
  Top 0.254: 52.6,33.81 54.5,31.91 | U1.1 54.5,31.79
  Top 0.305: U$5.P$4 54.5,31.91 54.5,31.79
  Top 0.406: C8.1 52.6,33.81
N$10
  Top 0.254: U$5.P$1 55.78,29.04 55.81,29.07 U1.2
  Top 0.305: C9.1 53.86,29.04 U$5.P$1
N$11  (via drill 3.17)
  other vias: 2.54,42.55
N$12  (via drill 3.17)
  other vias: 2.54,2.7
N$13
  Top 0.254: U$7.27 U$7.26
N$14
  Top 1.27: Q5.3 F1.1
N$15
  Top 0.305: R13.1 6.99,29.15 6.99,30.64 J3.D+
N$16
  Top 0.305: R14.1 7.39,31.29 J3.D-
N$17  (via drill 1)
  other vias: 111.98,9.59
N$18
  Top 1.016: Q6.3 81.09,23.02 F2.1
N$21
  Top 0.305: R16.1 92.71,11.84 U$6.P$16
N$22
  Top 0.305: R17.1 95.25,12.94 U$6.P$17
N$28
  Top 1.27: X1.P 118.34,5.24 arc-90 U3.1
N$31  (via drill 0.5)  (1 unrouted)
  Top 0.61: RTC1.6 85.41,10.95 BT1.POWER0
  other vias: 85.41,12.38
N$32
  Top 0.406: D1.A R23.1
N$33
  Top 0.406: R24.1 D2.A
N$34
  Top 0.406: R25.1 D3.A
N$44
  Top 0.305: C12.2 38.54,12.8 J11.6
N$45
  Top 0.305: C13.2 35.24,10.26 J11.5
N$46
  Top 0.305: C14.2 33.02,13.24 J11.4
N$47
  Top 0.305: C15.2 30.48,9.94 J11.3
N$48
  Top 0.305: C16.2 28.26,12.92 J11.2
N$49
  Top 0.305: C17.2 26.03,9.3 J11.1
N$50
  Top 0.305: J3.ID 5.65,30 4.92,30 4.92,30.01 4.61,30.32 4.61,33.6 R38.1 15.88,33.6 R39.2
N$52
  Top 0.254: U$7.25 U$7.24
N$53
  Top 0.254: U$7.23 33,31.27 31.12,31.27 31.12,32.23
  Top 0.305: R45.2 31.12,32.23 R44.1
N$54
  Top 0.254: U$7.22 33.5,31.27 34.61,31.27 34.61,34.13 31.75,34.13 31.75,35.08
  Top 0.305: R47.1 31.75,35.08 R46.1
N$56
  Top 0.203: U4.23 69.11,28.9 R11.1
RADIO_CS  (via drill 0.5)
  Top 0.254: U1.22 62.74,22.55 62.74,21.69 62.93,21.5 63.99,21.5 64.18,21.69 64.18,22 v64.68,22.49
  Top 0.305: U3.7 v105.59,17.59
  Bottom 0.254: v105.59,17.59 102.39,20.64 88.42,20.64 87.7,21.52 85.74,21.52 68.66,21.48 67.64,22.49 v64.68,22.49
RADIO_INT  (via drill 0.5)
  Top 0.254: v64.77,17.94 64.77,18.17 66.63,19.96 66.63,24.07 66.12,24.58 U1.26
  Top 0.305: U3.9 100.77,15.59 v99.38,16.99
  Bottom 0.305: v64.77,17.94 64.93,18.1 65.09,18.13 71.47,18.13 72.58,19.24 83.31,19.24 83.98,18.45 93.65,18.45 93.85,18.46 93.86,18.45 97.92,18.45 v99.38,16.99
RST  (via drill 0.5)
  Top 0.254: U1.40 62.21,31.96 62.86,32.54 62.86,34.92 61.2,36.59 56.32,36.59 v54.39,38.52
  Top 0.305: R7.1 13.06,39.59 11.82,40.83 U$1.P$3 U$1.P$4 5.56,40.83 5.56,44.45 11.29,44.45 11.53,44.21 27.07,44.21 28.73,42.55 28.73,41.59 28.26,41.12 28.26,38.73 v28.58,38.42
  Bottom 0.305: ISP2.5 27.46,38.42 v28.58,38.42 28.76,38.23 32.6,38.23 34.94,40.8 50.17,40.8 50.92,40.05 50.92,38.02 53.86,38.02 53.96,38.12 54.3,38.43 v54.39,38.52
RTC_INT  (via drill 0.5)
  Top 0.254: U1.25 66.04,23.25 66.04,20.32 66.05,20.32 65.44,19.7 64.89,19.7 63.95,18.76 63.95,18.23 v62.07,16.35
  Top 0.305: RTC1.3 72.39,10.95 72.39,11.91 65.41,11.91 65.41,14.13 v61.59,14.13
  Bottom 0.305: v61.59,14.13 61.59,15.88 v62.07,16.35
RX_EXT  (via drill 0.5)
  Top 0.254: U1.27 66.34,25.07 67.19,24.23 67.19,19.14 64.99,16.94 64.12,16.94 v63.5,16.32
  Top 0.305: v63.18,13.18 63.18,5.56 64.81,3.92 64.81,3.45 66.34,1.92 76.45,1.92 77.83,3.45 77.83,4.49 77.09,5.22 76.05,5.22 74.79,3.97 J9.P$7
  Bottom 0.305: v63.18,13.18 63.18,16.03 63.21,16.03 v63.5,16.32
SCK  (via drill 0.5)
  Top 0.203: 61.71,23.09 61.71,28.25 62.71,29.25 63.73,29.25 65,30.52
  Top 0.254: 65,30.52 68.24,30.52 75.5,37.78 78.6,37.78 J10.P$4 | 61.71,23.09 61.71,23.08 U1.20 61.71,20.68 v62.89,19.49
  Top 0.305: U3.6 v105.59,15.59 | U$2.5 10,18.89 v22.23,18.89
  Top 0.406: J2.5 18.47,40.75 18.47,35.21 19.18,34.5 20.19,34.5 21.41,35.72 ISP2.3
  Bottom 0.254: v105.59,15.59 104.64,16.54 101.15,16.54 98.52,19.18 84.14,19.18 83.63,19.81 72.39,19.81 71.23,18.65 65.56,18.65 65.41,18.81 64.06,18.81 63.37,19.49 v62.89,19.49
  Bottom 0.305: v62.89,19.49 42.17,19.49 41.81,19.49 41,18.68 22.37,18.7 22.23,18.86 v22.23,18.89 22.23,19.21 | 22.23,19.38 22.23,19.21 | ISP2.3 22.23,21.39 21.83,20.99 21.83,20.48 | 21.83,20.48 21.83,19.99 22.23,19.59 22.23,19.21 | 21.83,20.48 21.83,20.78
SCL  (via drill 0.5)
  Top 0.203: U1.32 64.09,27.58 62.39,25.88 62.39,24.45 v62.71,24.13 | U4.25 69.45,28.1 69.45,26.99
  Top 0.254: 69.45,18.1 69.45,26.99 67.95,26.99 67.35,27.58 U1.32 | 72.87,19.21 95.25,19.21 R17.2 95.25,16.67 arc-90 95.24,16.67 87.47,16.67 87.47,13.49 | 87.47,13.49 RTC1.8 | 85.09,3.97 J9.P$10 | 85.09,3.97 86.33,2.72 | 86.33,2.16 87.09,1.4 90.71,1.4 91.44,2.14 91.44,3.33 92.08,3.97 93.34,3.97 94.61,2.7 | R5.1 72.87,19.21 | 72.87,19.21 72.23,19.21 71.12,18.1 69.45,18.1 | 87.47,13.49 87.47,6.35 85.09,3.97 | 69.45,18.1 69.22,17.86 IC1.6
  Top 0.305: 86.33,2.72 86.33,2.16 | 94.61,2.7 J1.4 | R42.1 23.45,24.87 Q9.2 23.45,22.84 v24.93,22.84
  Bottom 0.305: v62.71,24.13 59.56,24.13 58.58,23.15 24.93,23.15 v24.93,22.84
SCL_HV
  Top 0.254: Q9.3 26.51,25.72 27.15,24.92 29.21,24.92 29.5,25.21 U$7.2
  Top 0.305: Q9.3 25.4,25.72 25.4,28.04 R9.1
SD_CS  (via drill 0.5)
  Top 0.254: v57.15,16.67 58.21,17.73 U1.13
  Top 0.305: U$2.2 17.43,15.75 19.05,14.13 21.59,14.13 v21.59,16.67
  Bottom 0.305: v21.59,16.67 22.23,17.3 56.52,17.3 v57.15,16.67
SD_VCC  (via drill 0.5)
  Top 0.305: Q7.3 13.97,24.46 v13.97,24.29
  Bottom 0.305: v13.97,24.29 9.6,24.29 U$2.4
  other vias: 9.6,17.95
SD_VCC_CTRL  (via drill 0.5)
  Top 0.203: v70.33,25.8 70.33,26.12 U4.1
  Top 0.305: R22.2 16.19,27.88 Q7.1 16.24,26.51 17.46,26.51 22.7,21.27 23.97,21.27 v23.97,19.53 23.97,20 | v70.8,19.45 v73.82,22.38
  Bottom 0.305: v73.82,22.38 73.34,22.38 72.71,23.02 71.12,23.02 70.33,23.73 v70.33,25.8 | v23.97,19.53 24.13,19.37 40.82,19.37 42.01,20.56 62.83,20.48 63.13,20.48 64.24,19.37 69.85,19.37 | 69.85,19.37 69.86,19.37 | 69.85,19.37 70.01,19.45 v70.8,19.45
SDA  (via drill 0.5)
  Top 0.203: U1.31 64.23,27.08 63.18,26.04 v63.18,25.24 | U4.24 68.03,28.5 v67.79,28.26
  Top 0.254: U1.31 67.06,27.08 67.63,26.51 68.98,26.51 68.98,24.29 v68.64,24.29 68.58,24.22 68.58,13.81 70.48,13.81 IC1.5 70.48,17.52 75.09,17.52 | 77.47,17.52 R16.2 | 75.09,17.52 77.47,17.52 | RTC1.7 77.47,12.22 | 77.47,12.22 77.47,10.32 80.07,10.32 J9.P$9 81.97,2.06 85.09,2.06 86.52,0.64 90.65,0.64 J1.3 | 77.47,12.22 77.47,17.52 | v25.72,21.91 22.84,21.91 18.1,26.65 R43.1 | R4.1 75.09,17.52
  Top 0.305: R43.1 19.8,27.88 Q8.2
  Bottom 0.305: v63.18,25.24 63.52,24.91 63.52,23.79 62.36,22.64 26.45,22.64 v25.72,21.91 | v67.79,28.26 68.98,27.07 68.98,24.21 v68.64,24.29
SDA_HV
  Top 0.254: R8.1 24.45,28.04 24.45,24.45 29.53,24.45 30,24.92 U$7.3
  Top 0.305: Q8.3 21.9,28.04 R8.1
SPI_EXT_CS1  (via drill 0.5)
  Top 0.203: 76.2,36.99 75.88,36.99 73.82,34.92 73.82,31.43 73.19,30.8 U4.16
  Top 0.305: 76.2,36.99 v76.2,36.97
  Bottom 0.305: v76.2,36.97 76.2,38.4 75.59,39.01 75.59,42.67 74.3,43.81 16.35,43.81 J2.6
SPI_EXT_CS2  (via drill 0.5)
  Top 0.203: U4.14 74.86,29.3 v75.56,30
  Bottom 0.305: v75.56,30 77.83,30 J10.P$6
TX_EXT  (via drill 0.5)
  Top 0.254: 64.93,16.19 67.83,19.1 67.83,24.32 66.6,25.56 65.23,25.56 U1.28
  Top 0.305: v64.45,13.18 64.45,6.83 65.72,6.83 68.31,4.23 68.31,3.45 69.05,2.71 69.84,2.71 69.85,2.7 75.3,2.7 J9.P$8 | v64.93,16.08 64.93,16.19
  Bottom 0.305: 65.09,16.35 v64.93,16.08 64.93,14.92 64.45,14.45 v64.45,13.18
USB_D+  (via drill 0.5)
  Top 0.203: U1.34 63.19,28.58 v62.71,28.1
  Top 0.305: R13.2 11.98,28.1 14.48,30.6 25.68,30.6 v26.19,31.11
  Bottom 0.305: v62.71,28.1 61.91,28.1 58.1,24.29 33.02,24.29 v26.19,31.11
USB_D-  (via drill 0.5)
  Top 0.203: v62.47,26.99 62.71,26.99 63.82,28.1 64.41,28.1
  Top 0.254: U1.33 64.43,28.08 64.41,28.1
  Top 0.305: R14.2 13.8,30.64 14.27,31.11 23.41,31.11 v24.21,31.91
  Bottom 0.305: v62.47,26.99 61.59,26.99 58.26,23.65 32.54,23.65 v24.21,31.91
USB_HOST_EN  (via drill 0.5)
  Top 0.203: U1.41 61.71,32.5 v62.07,32.94
  Top 0.305: v48.89,25.56 48.26,25.56 46.18,27.64 41.57,27.64 40.79,26.86 v40.67,26.86 | v25.72,32.86 18.63,32.86 R39.1
  Bottom 0.305: v62.07,32.94 54.69,25.56 v48.89,25.56 | v40.67,26.86 31.72,26.86 v25.72,32.86

### Text on the board
tDocu: SPI | A6 | A7 | A8 | A9 | A10 | A11 | D0 | D1 | D2 | D3 | GND | DI | DO | SCK | 3V3 | CS2 | D6 | 3V3 | 5V | GND | VIN | RESET | ISP | GND | A0 | 3V3 | A1 | 3V3 | A2 | GND | A3 | 3V3 | A4 | 3V3 | A5 | INT1 | 5V | 3V3 | GND | RX | TX | SDA | SCL | LOG | I2C